# EAGLE schematic ControlBoard03_v03_short (EAGLE 7.7.0), part 1 of 2

## Sheet 1 of 10: RPi Zero 2 W
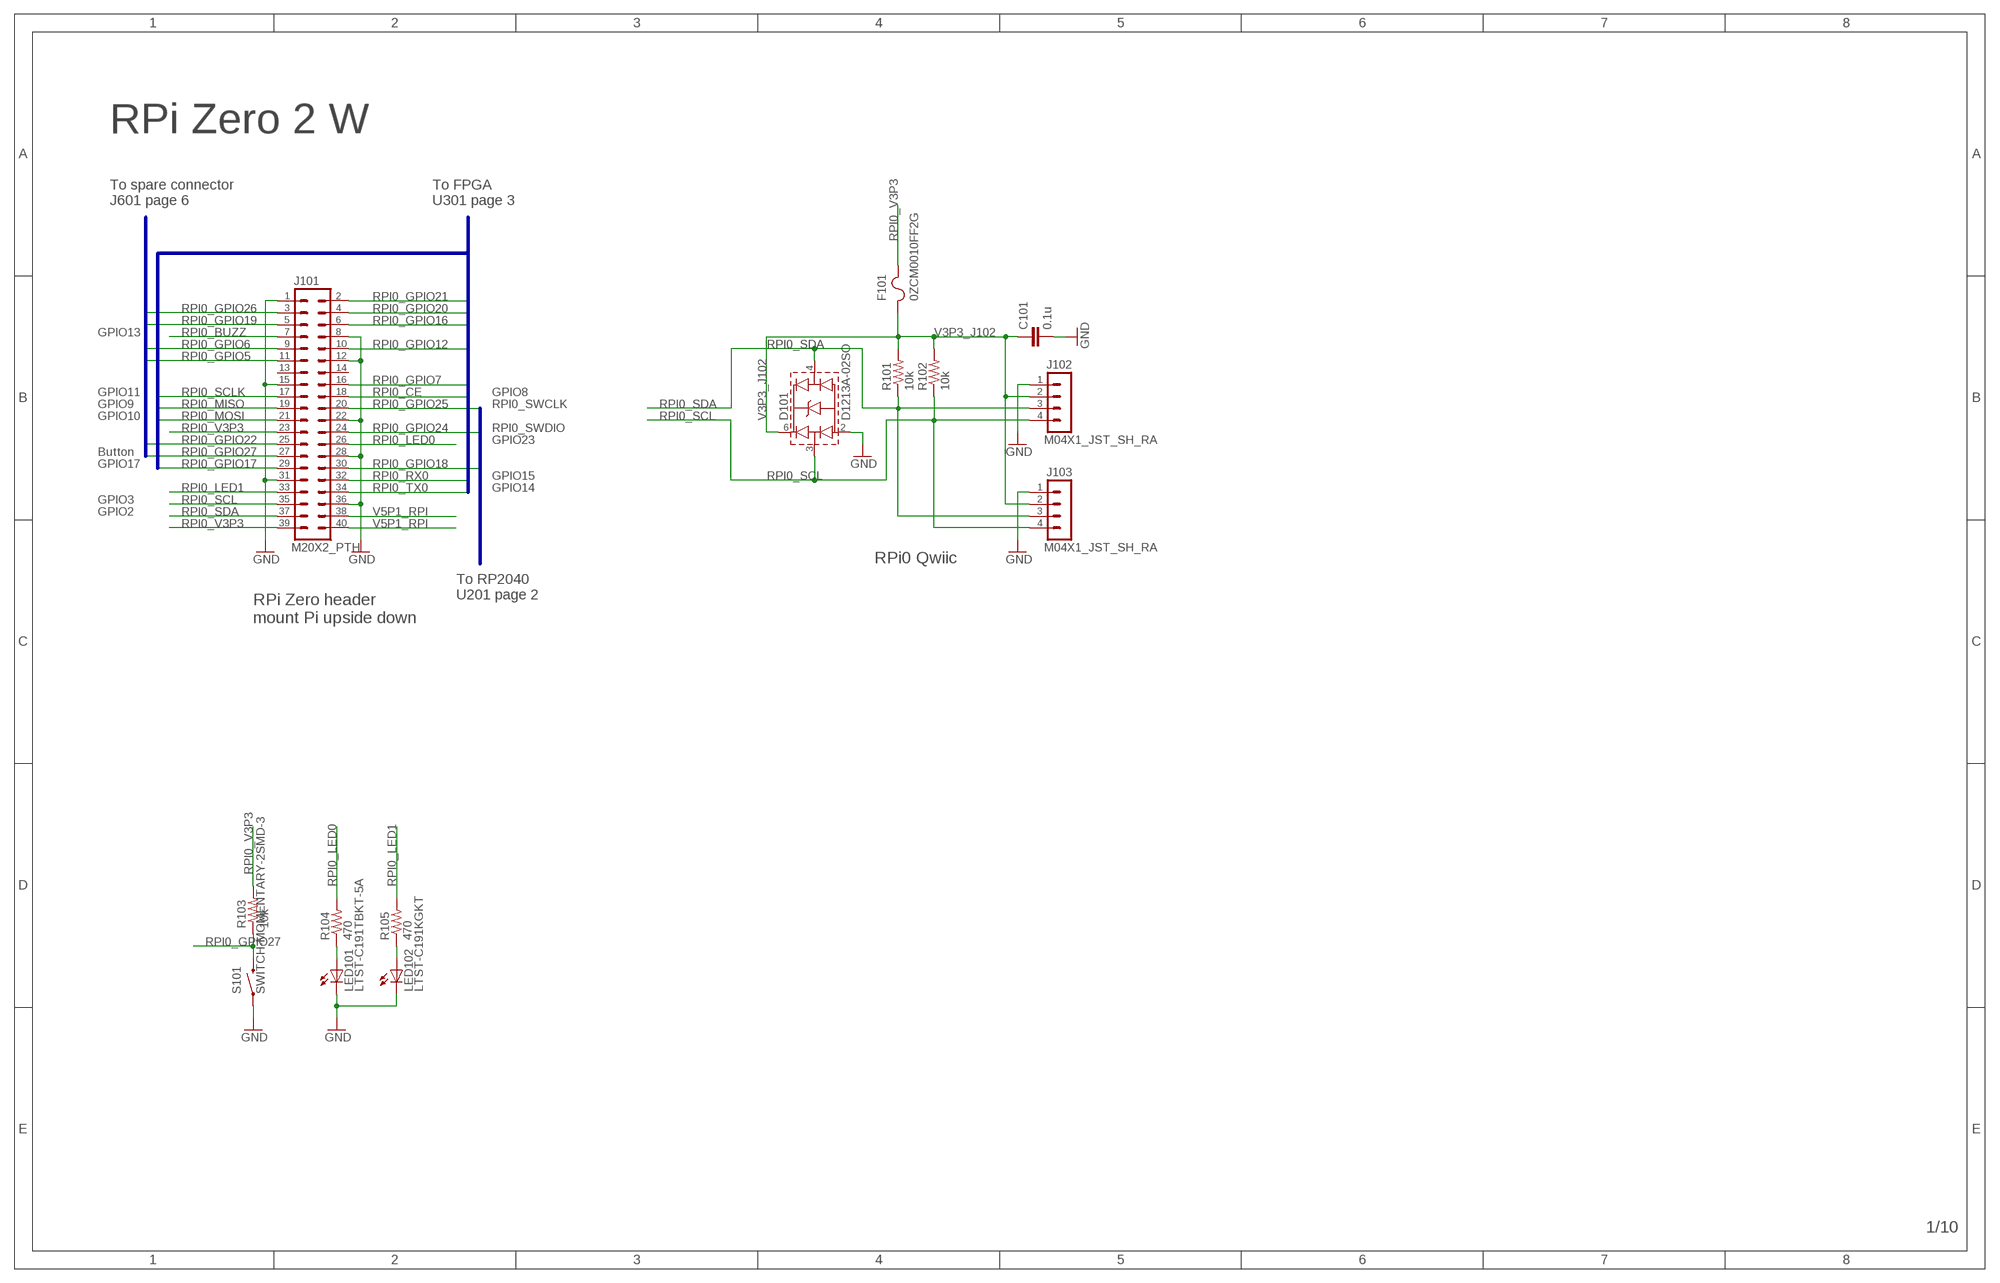
[diagram p0: schematic, sheet 1]

### Parts
C101  0.1u  CAP0402-CAP  [0402-CAP]
D101  D1213A-02SO  [SOT23-6]
F101  0ZCM0010FF2G  FUSE_0603  [0603-RES]
J101  M20X2_PTH  [M20X2_PTH]
J102  M04X1_JST_SH_RA  [M04X1_JST_SH_SM_RA]
J103  M04X1_JST_SH_RA  [M04X1_JST_SH_SM_RA]
LED101  LTST-C191TBKT-5A  LED0603  [LED-0603]
LED102  LTST-C191KGKT  LED0603  [LED-0603]
R101  10k  RESISTOR0402-RES  [0402-RES]
R102  10k  RESISTOR0402-RES  [0402-RES]
R103  10k  RESISTOR0402-RES  [0402-RES]
R104  470  RESISTOR0402-RES  [0402-RES]
R105  470  RESISTOR0402-RES  [0402-RES]
S101  SWITCH-MOMENTARY-2SMD-3  [TACTILE_SWITCH_SMD-3]

### Nets
GND: C101.2 D101.2(VN) J101.1 J101.8 J101.12 J101.15 J101.22 J101.28 J101.31 J101.36 J102.1 J103.1 LED101.C LED102.C S101.1 ; also sheet 2,3,4,5,6,7,8,9,10
N$86: LED101.A R104.1
N$88: LED102.A R105.1
RPI0_BUZZ: J101.7 ; also sheet 6
RPI0_CE: J101.18 ; also sheet 3
RPI0_GPIO5: J101.11
RPI0_GPIO6: J101.9
RPI0_GPIO7: J101.16 ; also sheet 3
RPI0_GPIO12: J101.10 ; also sheet 3
RPI0_GPIO16: J101.6 ; also sheet 3
RPI0_GPIO17: J101.29 ; also sheet 3
RPI0_GPIO18: J101.30 ; also sheet 2
RPI0_GPIO19: J101.5
RPI0_GPIO20: J101.4 ; also sheet 3
RPI0_GPIO21: J101.2 ; also sheet 3
RPI0_GPIO22: J101.25
RPI0_GPIO24: J101.24 ; also sheet 2
RPI0_GPIO25: J101.20 ; also sheet 2
RPI0_GPIO26: J101.3
RPI0_GPIO27: J101.27 R103.1 S101.4
RPI0_LED0: J101.26 R104.2
RPI0_LED1: J101.33 R105.2
RPI0_MISO: J101.19 ; also sheet 3
RPI0_MOSI: J101.21 ; also sheet 3
RPI0_RX0: J101.32 ; also sheet 3
RPI0_SCL: D101.3(CH1) J101.35 J102.4 J103.4 R102.1 ; also sheet 3
RPI0_SCLK: J101.17 ; also sheet 3
RPI0_SDA: D101.4(CH2) J101.37 J102.3 J103.3 R101.1 ; also sheet 3
RPI0_TX0: J101.34 ; also sheet 3
RPI0_V3P3: F101.2 J101.23 J101.39 R103.2
V3P3_J102: C101.1 D101.6(VP) F101.1 J102.2 J103.2 R101.2 R102.2
V5P1_RPI: J101.38 J101.40 ; also sheet 7
Unconnected: J101.13 J101.14

### Buses
RPI0_GPIO7,RPI0_GPIO12,RPI0_GPIO16,RPI0_GPIO20,RPI0_GPIO21,RPI0_SCLK,RPI0_MISO,RPI0_MOSI,RPI0_CE,RPI0_RX0,RPI0_TX0,RPI0_LED0
RPI0_GPIO18,RPI0_GPIO24,RPI0_GPIO25,RPI0_RX0,RPI0_TX0
RPI0_GPIO5,RPI0_GPIO6,RPI0_GPIO19,RPI0_GPIO22,RPI0_GPIO26,RPI0_GPIO27

### Notes on the sheet
- RPi Zero 2 W
- To spare connector
  J601 page 6
- To FPGA
  U301 page 3
- GPIO13
- GPIO11 | GPIO8
- GPIO9 | RPI0_SWCLK
- GPIO10
- RPI0_SWDIO
- GPIO23
- Button
- GPIO17
- GPIO15
- GPIO14
- GPIO3
- GPIO2
- RPi0 Qwiic
- To RP2040
  U201 page 2
- RPi Zero header
  mount Pi upside down

## Sheet 2 of 10: RP2040 MCU
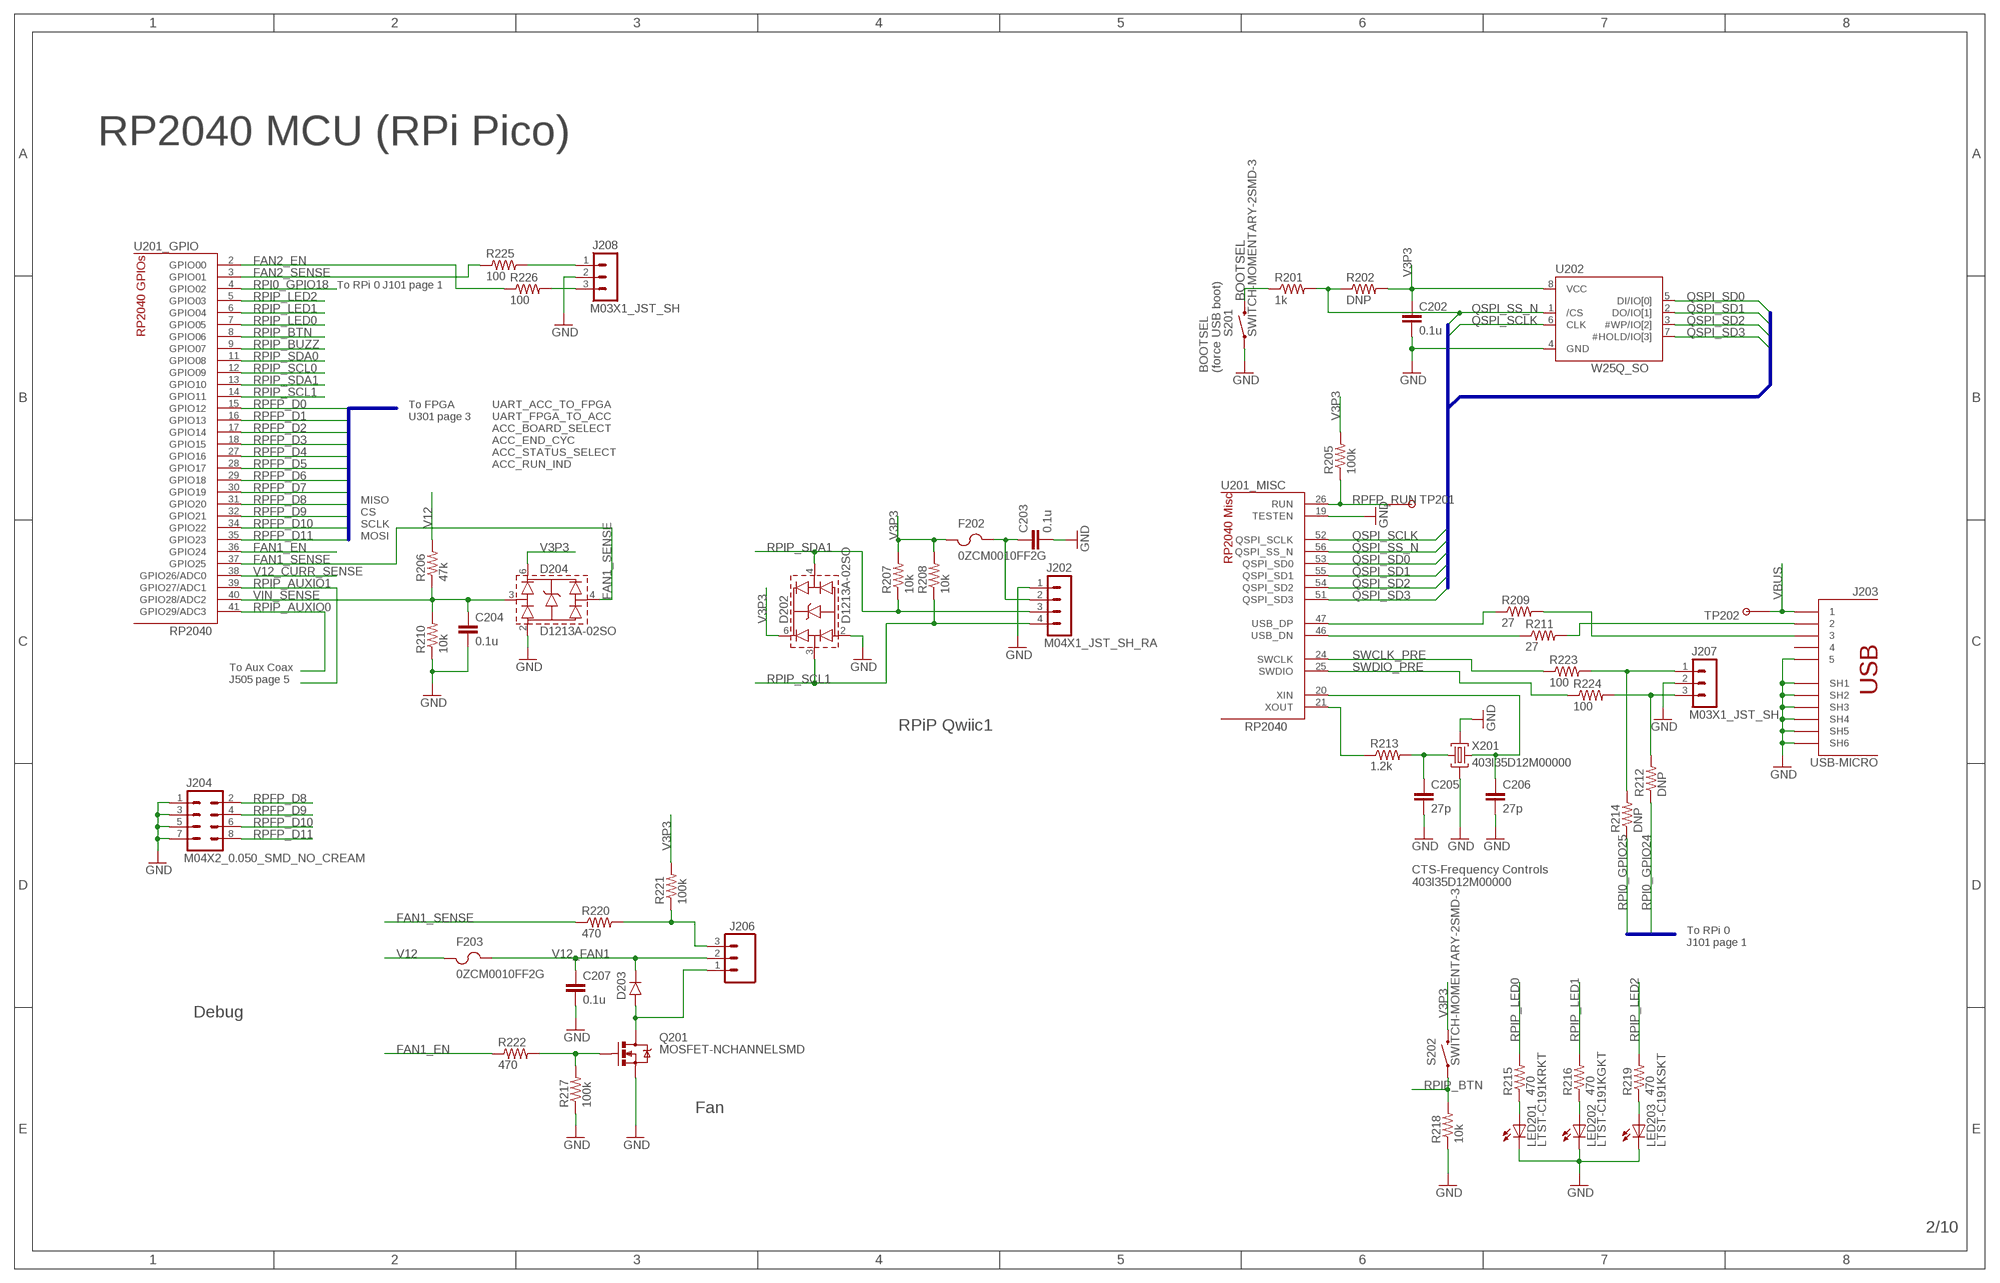
[diagram p1: schematic, sheet 2]

### Parts
C202  0.1u  CAP0402-CAP  [0402-CAP]
C203  0.1u  CAP0402-CAP  [0402-CAP]
C204  0.1u  CAP0402-CAP  [0402-CAP]
C205  27p  CAP0402-CAP  [0402-CAP]
C206  27p  CAP0402-CAP  [0402-CAP]
C207  0.1u  CAP0402-CAP  [0402-CAP]
D202  D1213A-02SO  [SOT23-6]
D203  DIODE_SOD523  [SOD523]
D204  D1213A-02SO  [SOT23-6]
F202  0ZCM0010FF2G  FUSE_0603  [0603-RES]
F203  0ZCM0010FF2G  FUSE_0603  [0603-RES]
J202  M04X1_JST_SH_RA  [M04X1_JST_SH_SM_RA]
J203  USB-MICRO  [USB-MICRO]
J204  M04X2_0.050_SMD_NO_CREAM  [M04X2_0.050_SMD_NO_CREAM]
J206  M03POLAR  [MOLEX-1X3]
J207  M03X1_JST_SH  [M03X1_JST_SH_SM]
J208  M03X1_JST_SH  [M03X1_JST_SH_SM]
LED201  LTST-C191KRKT  LED0603  [LED-0603]
LED202  LTST-C191KGKT  LED0603  [LED-0603]
LED203  LTST-C191KSKT  LED0603  [LED-0603]
Q201  MOSFET-NCHANNELSMD  [SOT23-3]
R201  1k  RESISTOR0402-RES  [0402-RES]
R202  DNP  RESISTOR0402-RES  [0402-RES]
R205  100k  RESISTOR0402-RES  [0402-RES]
R206  47k  RESISTOR0402-RES  [0402-RES]
R207  10k  RESISTOR0402-RES  [0402-RES]
R208  10k  RESISTOR0402-RES  [0402-RES]
R209  27  RESISTOR0402-RES  [0402-RES]
R210  10k  RESISTOR0402-RES  [0402-RES]
R211  27  RESISTOR0402-RES  [0402-RES]
R212  DNP  RESISTOR0402-RES  [0402-RES]
R213  1.2k  RESISTOR0402-RES  [0402-RES]
R214  DNP  RESISTOR0402-RES  [0402-RES]
R215  470  RESISTOR0402-RES  [0402-RES]
R216  470  RESISTOR0402-RES  [0402-RES]
R217  100k  RESISTOR0402-RES  [0402-RES]
R218  10k  RESISTOR0402-RES  [0402-RES]
R219  470  RESISTOR0402-RES  [0402-RES]
R220  470  RESISTOR0402-RES  [0402-RES]
R221  100k  RESISTOR0402-RES  [0402-RES]
R222  470  RESISTOR0402-RES  [0402-RES]
R223  100  RESISTOR0402-RES  [0402-RES]
R224  100  RESISTOR0402-RES  [0402-RES]
R225  100  RESISTOR0402-RES  [0402-RES]
R226  100  RESISTOR0402-RES  [0402-RES]
S201  SWITCH-MOMENTARY-2SMD-3  [TACTILE_SWITCH_SMD-3]
S202  SWITCH-MOMENTARY-2SMD-3  [TACTILE_SWITCH_SMD-3]
TP201  TESTPOINT_ROUND  [TESTPAD_ROUND]
TP202  TESTPOINT_ROUND  [TESTPAD_ROUND]
U201  RP2040  [QFN-56_EP]
U202  W25Q_SO  [SO08-208MIL]
X201  403I35D12M00000  CRYSTAL-3.2-2.5  [CRYSTAL-3.2-2.5]

### Nets
BOOTSEL: R201.1 S201.4
FAN1_EN: R222.1 U201.36(_GPIO:GPIO24)
FAN1_SENSE: D204.4(CH2) R220.1 U201.37(_GPIO:GPIO25)
FAN2_EN: R226.1 U201.2(_GPIO:GPIO00)
FAN2_SENSE: R225.1 U201.3(_GPIO:GPIO01)
GND: C202.2 C203.2 C204.2 C205.2 C206.2 C207.2 D202.2(VN) D204.2(VN) J202.1 J203.5 J203.SH1 J203.SH2 J203.SH3 J203.SH4 J203.SH5 J203.SH6 J204.1 J204.3 J204.5 J204.7 J207.2 J208.2 LED201.C LED202.C LED203.C Q201.2(S) R210.1 R217.1 R218.1 S201.1 U201.19(_MISC:TESTEN) U202.4(GND) X201.2(GND) X201.4(GND) ; also sheet 1,3,4,5,6,7,8,9,10
N$16: C206.1 U201.20(_MISC:XIN) X201.3(C2)
N$17: C205.1 R213.2 X201.1(C1)
N$18: R213.1 U201.21(_MISC:XOUT)
N$29: R209.1 U201.47(_MISC:USB_DP)
N$30: R211.1 U201.46(_MISC:USB_DN)
N$35: J203.2 R211.2
N$37: J203.3 R209.2
N$46: J208.3 R226.2
N$47: J208.1 R225.2
N$63: LED203.A R219.1
N$83: J206.3 R220.2 R221.1
N$85: LED202.A R216.1
N$91: LED201.A R215.1
N$92: D203.A J206.1 Q201.3(D)
N$98: Q201.1(G) R217.2 R222.2
QSPI_SCLK: U201.52(_MISC:QSPI_SCLK) U202.6(CLK)
QSPI_SD0: U201.53(_MISC:QSPI_SD0) U202.5(DI/IO[0])
QSPI_SD1: U201.55(_MISC:QSPI_SD1) U202.2(DO/IO[1])
QSPI_SD2: U201.54(_MISC:QSPI_SD2) U202.3(#WP/IO[2])
QSPI_SD3: U201.51(_MISC:QSPI_SD3) U202.7(#HOLD/IO[3])
QSPI_SS_N: R201.2 R202.1 U201.56(_MISC:QSPI_SS_N) U202.1(/CS)
RPFP_D0: U201.15(_GPIO:GPIO12) ; also sheet 3
RPFP_D1: U201.16(_GPIO:GPIO13) ; also sheet 3
RPFP_D2: U201.17(_GPIO:GPIO14) ; also sheet 3
RPFP_D3: U201.18(_GPIO:GPIO15) ; also sheet 3
RPFP_D4: U201.27(_GPIO:GPIO16) ; also sheet 3
RPFP_D5: U201.28(_GPIO:GPIO17) ; also sheet 3
RPFP_D6: U201.29(_GPIO:GPIO18) ; also sheet 3
RPFP_D7: U201.30(_GPIO:GPIO19) ; also sheet 3
RPFP_D8: J204.2 U201.31(_GPIO:GPIO20) ; also sheet 3
RPFP_D9: J204.4 U201.32(_GPIO:GPIO21) ; also sheet 3
RPFP_D10: J204.6 U201.34(_GPIO:GPIO22) ; also sheet 3
RPFP_D11: J204.8 U201.35(_GPIO:GPIO23) ; also sheet 3
RPFP_RUN: R205.1 TP201.P$1 U201.26(_MISC:RUN) ; also sheet 3
RPI0_GPIO18: U201.4(_GPIO:GPIO02) ; also sheet 1
RPI0_GPIO24: R212.1 ; also sheet 1
RPI0_GPIO25: R214.1 ; also sheet 1
RPIP_AUXIO0: U201.41(_GPIO:GPIO29/ADC3) ; also sheet 5
RPIP_AUXIO1: U201.39(_GPIO:GPIO27/ADC1) ; also sheet 5
RPIP_BTN: R218.2 S202.1 U201.8(_GPIO:GPIO06)
RPIP_BUZZ: U201.9(_GPIO:GPIO07) ; also sheet 6
RPIP_LED0: R215.2 U201.7(_GPIO:GPIO05)
RPIP_LED1: R216.2 U201.6(_GPIO:GPIO04)
RPIP_LED2: R219.2 U201.5(_GPIO:GPIO03)
RPIP_SCL0: U201.12(_GPIO:GPIO09)
RPIP_SCL1: D202.3(CH1) J202.4 R208.1 U201.14(_GPIO:GPIO11)
RPIP_SDA0: U201.11(_GPIO:GPIO08)
RPIP_SDA1: D202.4(CH2) J202.3 R207.1 U201.13(_GPIO:GPIO10)
SWCLK: J207.1 R214.2 R223.2
SWCLK_PRE: R223.1 U201.24(_MISC:SWCLK)
SWDIO: J207.3 R212.2 R224.2
SWDIO_PRE: R224.1 U201.25(_MISC:SWDIO)
V3P3: C202.1 D202.6(VP) D204.6(VP) F202.1 R202.2 R205.2 R207.2 R208.2 R221.2 S202.4 U202.8(VCC) ; also sheet 3,5,6,7,9,10
V3P3_J202: C203.1 F202.2 J202.2
V12: F203.1 R206.2 ; also sheet 7,8,9,10
V12_CURR_SENSE: U201.38(_GPIO:GPIO26/ADC0) ; also sheet 10
V12_FAN1: C207.1 D203.C F203.2 J206.2
VBUS: J203.1 TP202.P$1
VIN_SENSE: C204.1 D204.3(CH1) R206.1 R210.2 U201.40(_GPIO:GPIO28/ADC2)
Unconnected: J203.4

### Buses
QSPI_SCLK,QSPI_SS_N,QSPI_SD[0..3]
RPI0_GPIO18,RPI0_GPIO24,RPI0_GPIO25,RPI0_RX0,RPI0_TX0
RPIP_GPIO[12..19],RPIP_MISO0,RPIP_MOSI0,RPIP_SCLK0,RPIP_CS0

### Notes on the sheet
- RP2040 MCU (RPi Pico)
- To RPi 0 J101 page 1
- BOOTSEL
  (force USB boot)
- UART_ACC_TO_FPGA
- To FPGA
  U301 page 3
- UART_FPGA_TO_ACC
- ACC_BOARD_SELECT
- ACC_END_CYC
- ACC_STATUS_SELECT
- ACC_RUN_IND
- MISO
- CS
- SCLK
- MOSI
- To Aux Coax
  J505 page 5
- RPiP Qwiic1
- CTS-Frequency Controls
  403I35D12M00000
- To RPi 0
  J101 page 1
- Debug
- Fan

## Sheet 3 of 10: FPGA
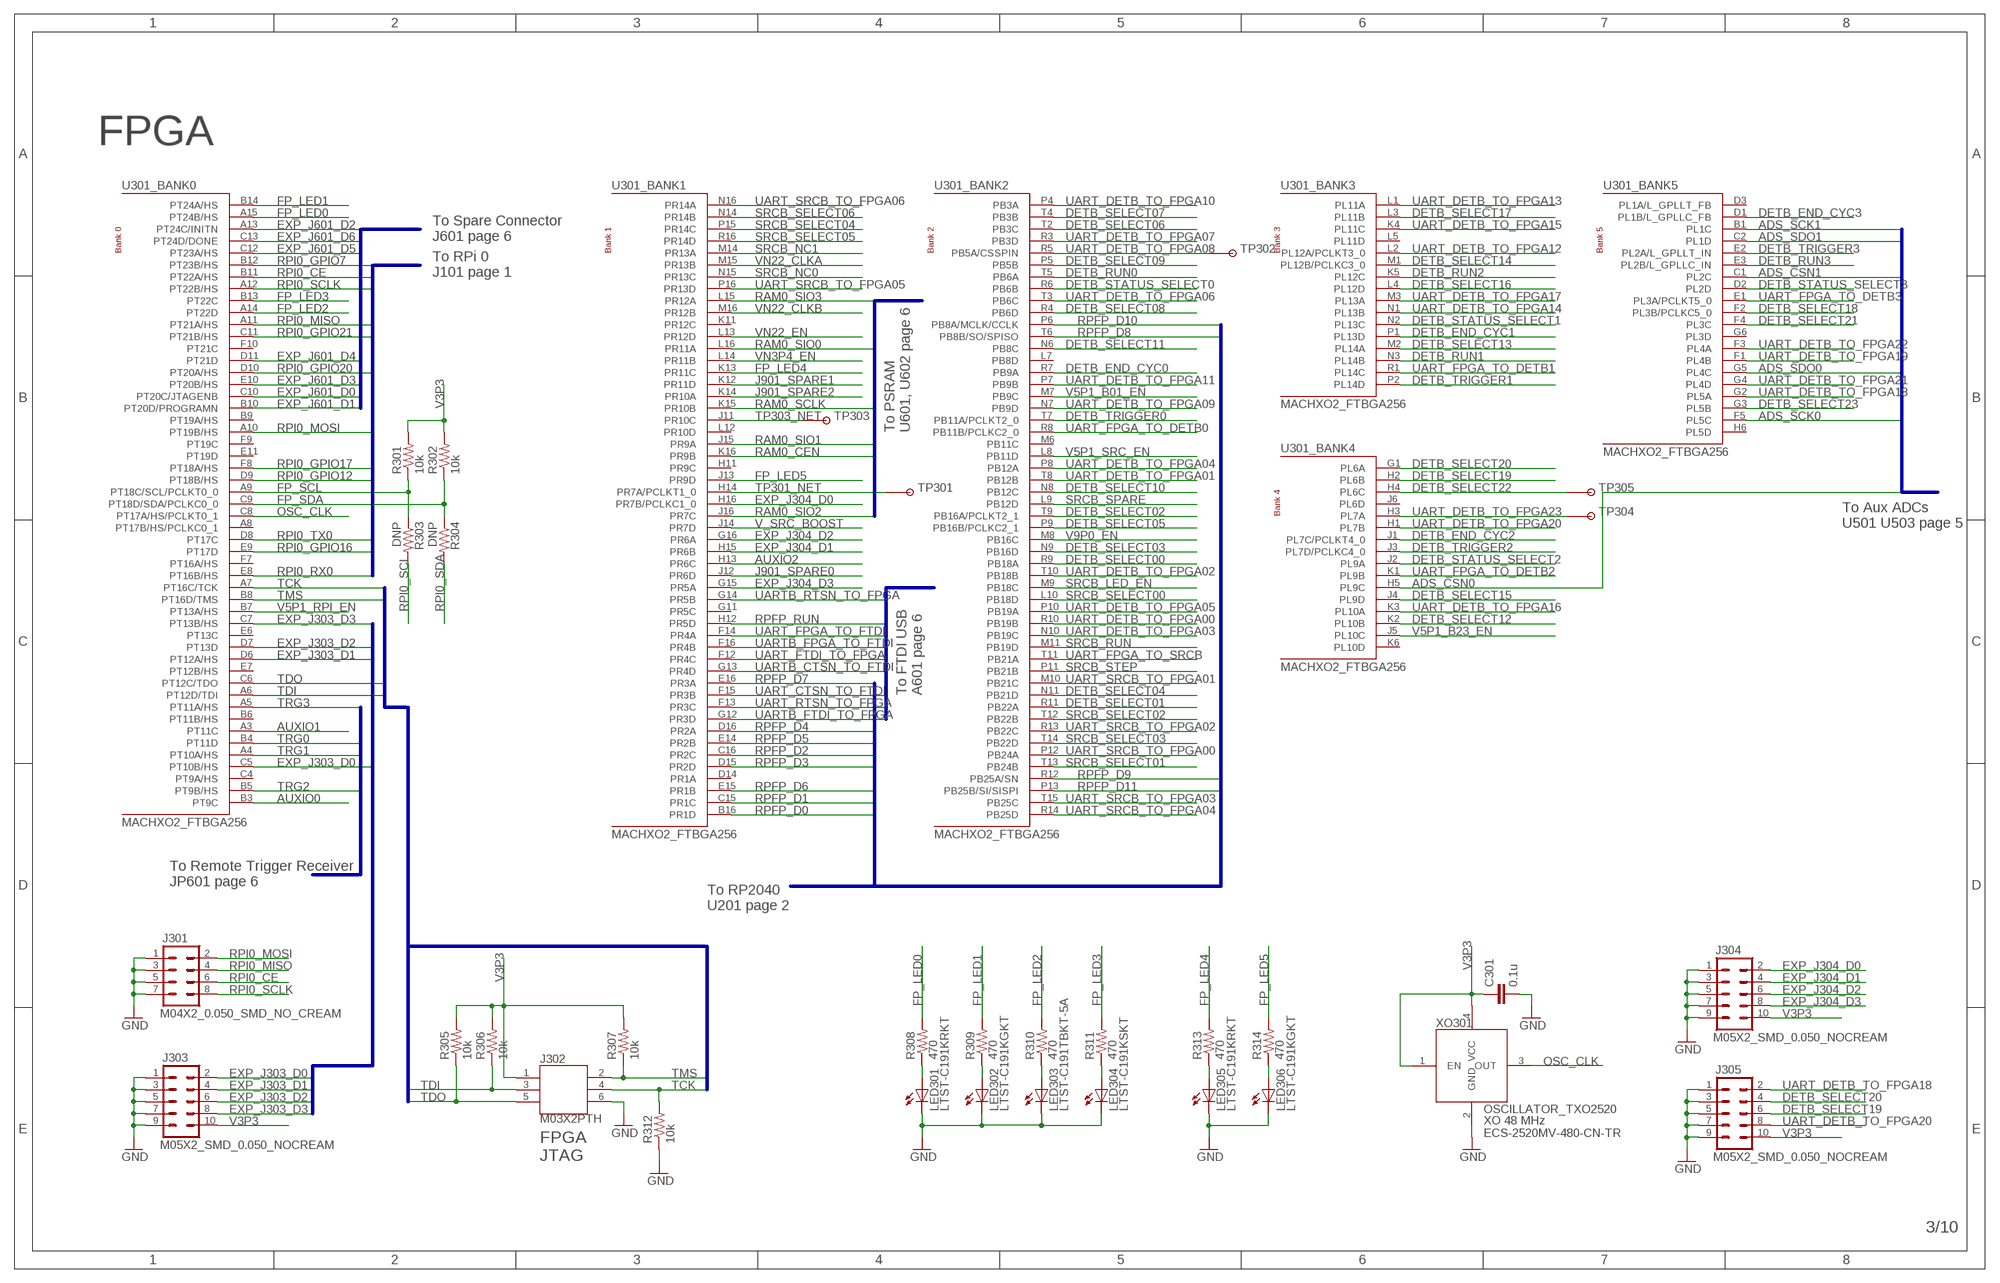
[diagram p2: schematic, sheet 3]

### Parts
C301  0.1u  CAP0402-CAP  [0402-CAP]
J301  M04X2_0.050_SMD_NO_CREAM  [M04X2_0.050_SMD_NO_CREAM]
J302  M03X2PTH  [2X3-NS]
J303  M05X2_SMD_0.050_NOCREAM  [M05X2_0.050_SMD_NO_CREAM]
J304  M05X2_SMD_0.050_NOCREAM  [M05X2_0.050_SMD_NO_CREAM]
J305  M05X2_SMD_0.050_NOCREAM  [M05X2_0.050_SMD_NO_CREAM]
LED301  LTST-C191KRKT  LED0603  [LED-0603]
LED302  LTST-C191KGKT  LED0603  [LED-0603]
LED303  LTST-C191TBKT-5A  LED0603  [LED-0603]
LED304  LTST-C191KSKT  LED0603  [LED-0603]
LED305  LTST-C191KRKT  LED0603  [LED-0603]
LED306  LTST-C191KGKT  LED0603  [LED-0603]
R301  10k  RESISTOR0402-RES  [0402-RES]
R302  10k  RESISTOR0402-RES  [0402-RES]
R303  DNP  RESISTOR0402-RES  [0402-RES]
R304  DNP  RESISTOR0402-RES  [0402-RES]
R305  10k  RESISTOR0402-RES  [0402-RES]
R306  10k  RESISTOR0402-RES  [0402-RES]
R307  10k  RESISTOR0402-RES  [0402-RES]
R308  470  RESISTOR0402-RES  [0402-RES]
R309  470  RESISTOR0402-RES  [0402-RES]
R310  470  RESISTOR0402-RES  [0402-RES]
R311  470  RESISTOR0402-RES  [0402-RES]
R312  10k  RESISTOR0402-RES  [0402-RES]
R313  470  RESISTOR0402-RES  [0402-RES]
R314  470  RESISTOR0402-RES  [0402-RES]
TP301  TESTPOINT_ROUND  [TESTPAD_ROUND]
TP302  TESTPOINTPADSMALL  [TESTPAD_SMALL]
TP303  TESTPOINT_ROUND  [TESTPAD_ROUND]
TP304  TESTPOINT_ROUND  [TESTPAD_ROUND]
TP305  TESTPOINT_ROUND  [TESTPAD_ROUND]
U301  MACHXO2_FTBGA256  [LBGA-256]
XO301  OSCILLATOR_TXO2520  [TXO2520]

### Nets
ADS_CSN0: U301.H5(_BANK4:PL9C)
ADS_CSN1: U301.C1(_BANK5:PL2C)
ADS_SCK0: U301.F5(_BANK5:PL5C)
ADS_SCK1: U301.B1(_BANK5:PL1C)
ADS_SDO0: U301.G5(_BANK5:PL4C)
ADS_SDO1: U301.C2(_BANK5:PL1D)
AUXIO0: U301.B3(_BANK0:PT9C) ; also sheet 5
AUXIO1: U301.A3(_BANK0:PT11C) ; also sheet 5
AUXIO2: U301.H13(_BANK1:PR6C) ; also sheet 5
DETB_END_CYC0: U301.R7(_BANK2:PB9A) ; also sheet 4
DETB_END_CYC1: U301.P1(_BANK3:PL13D) ; also sheet 4
DETB_END_CYC2: U301.J1(_BANK4:PL7C/PCLKT4_0) ; also sheet 4
DETB_END_CYC3: U301.D1(_BANK5:PL1B/L_GPLLC_FB)
DETB_RUN0: U301.T5(_BANK2:PB6A) ; also sheet 4
DETB_RUN1: U301.N3(_BANK3:PL14B) ; also sheet 4
DETB_RUN2: U301.K5(_BANK3:PL12C) ; also sheet 4
DETB_RUN3: U301.E3(_BANK5:PL2B/L_GPLLC_IN)
DETB_SELECT00: U301.R9(_BANK2:PB18A) ; also sheet 4
DETB_SELECT01: U301.R11(_BANK2:PB22A) ; also sheet 4
DETB_SELECT02: U301.T9(_BANK2:PB16A/PCLKT2_1) ; also sheet 4
DETB_SELECT03: U301.N9(_BANK2:PB16D) ; also sheet 4
DETB_SELECT04: U301.N11(_BANK2:PB21D) ; also sheet 4
DETB_SELECT05: U301.P9(_BANK2:PB16B/PCLKC2_1) ; also sheet 4
DETB_SELECT06: U301.T2(_BANK2:PB3C) ; also sheet 4
DETB_SELECT07: U301.T4(_BANK2:PB3B) ; also sheet 4
DETB_SELECT08: U301.R4(_BANK2:PB6D) ; also sheet 4
DETB_SELECT09: U301.P5(_BANK2:PB5B) ; also sheet 4
DETB_SELECT10: U301.N8(_BANK2:PB12C) ; also sheet 4
DETB_SELECT11: U301.N6(_BANK2:PB8C) ; also sheet 4
DETB_SELECT12: U301.K2(_BANK4:PL10B) ; also sheet 4
DETB_SELECT13: U301.M2(_BANK3:PL14A) ; also sheet 4
DETB_SELECT14: U301.M1(_BANK3:PL12B/PCLKC3_0) ; also sheet 4
DETB_SELECT15: U301.J4(_BANK4:PL9D) ; also sheet 4
DETB_SELECT16: U301.L4(_BANK3:PL12D) ; also sheet 4
DETB_SELECT17: U301.L3(_BANK3:PL11B) ; also sheet 4
DETB_SELECT18: U301.F2(_BANK5:PL3B/PCLKC5_0)
DETB_SELECT19: J305.6 U301.H2(_BANK4:PL6B)
DETB_SELECT20: J305.4 U301.G1(_BANK4:PL6A)
DETB_SELECT21: U301.F4(_BANK5:PL3C)
DETB_SELECT22: TP305.P$1 U301.H4(_BANK4:PL6C)
DETB_SELECT23: U301.G3(_BANK5:PL5B)
DETB_STATUS_SELECT0: U301.R6(_BANK2:PB6B) ; also sheet 4
DETB_STATUS_SELECT1: U301.N2(_BANK3:PL13C) ; also sheet 4
DETB_STATUS_SELECT2: U301.J2(_BANK4:PL9A) ; also sheet 4
DETB_STATUS_SELECT3: U301.D2(_BANK5:PL2D)
DETB_TRIGGER0: U301.T7(_BANK2:PB11A/PCLKT2_0) ; also sheet 4
DETB_TRIGGER1: U301.P2(_BANK3:PL14D) ; also sheet 4
DETB_TRIGGER2: U301.J3(_BANK4:PL7D/PCLKC4_0) ; also sheet 4
DETB_TRIGGER3: U301.E2(_BANK5:PL2A/L_GPLLT_IN)
EXP_J303_D0: J303.2 U301.C5(_BANK0:PT10B/HS)
EXP_J303_D1: J303.4 U301.D6(_BANK0:PT12A/HS)
EXP_J303_D2: J303.6 U301.D7(_BANK0:PT13D)
EXP_J303_D3: J303.8 U301.C7(_BANK0:PT13B/HS)
EXP_J304_D0: J304.2 U301.H16(_BANK1:PR7B/PCLKC1_0)
EXP_J304_D1: J304.4 U301.H15(_BANK1:PR6B)
EXP_J304_D2: J304.6 U301.G16(_BANK1:PR6A)
EXP_J304_D3: J304.8 U301.G15(_BANK1:PR5A)
EXP_J601_D0: U301.C10(_BANK0:PT20C/JTAGENB)
EXP_J601_D1: U301.B10(_BANK0:PT20D/PROGRAMN)
EXP_J601_D2: U301.A13(_BANK0:PT24C/INITN)
EXP_J601_D3: U301.E10(_BANK0:PT20B/HS)
EXP_J601_D4: U301.D11(_BANK0:PT21D)
EXP_J601_D5: U301.C12(_BANK0:PT23A/HS)
EXP_J601_D6: U301.C13(_BANK0:PT24D/DONE)
FP_LED0: R308.2 U301.A15(_BANK0:PT24B/HS)
FP_LED1: R309.2 U301.B14(_BANK0:PT24A/HS)
FP_LED2: R310.2 U301.A14(_BANK0:PT22D)
FP_LED3: R311.2 U301.B13(_BANK0:PT22C)
FP_LED4: R313.2 U301.K13(_BANK1:PR11C)
FP_LED5: R314.2 U301.J13(_BANK1:PR9D)
FP_SCL: R301.1 R303.1 U301.A9(_BANK0:PT18C/SCL/PCLKT0_0)
FP_SDA: R302.1 R304.1 U301.C9(_BANK0:PT18D/SDA/PCLKC0_0)
GND: C301.2 J301.1 J301.3 J301.5 J301.7 J302.6 J303.1 J303.3 J303.5 J303.7 J303.9 J304.1 J304.3 J304.5 J304.7 J304.9 J305.1 J305.3 J305.5 J305.7 J305.9 LED301.C LED302.C LED303.C LED304.C LED305.C LED306.C R312.1 XO301.2(GND) ; also sheet 1,2,4,5,6,7,8,9,10
J901_SPARE0: U301.J12(_BANK1:PR6D) ; also sheet 9
J901_SPARE1: U301.K12(_BANK1:PR11D) ; also sheet 9
J901_SPARE2: U301.K14(_BANK1:PR10A) ; also sheet 9
N$55: LED301.A R308.1
N$56: LED302.A R309.1
N$57: LED303.A R310.1
N$58: LED304.A R311.1
N$84: LED305.A R313.1
N$90: LED306.A R314.1
OSC_CLK: U301.C8(_BANK0:PT17A/HS/PCLKT0_1) XO301.3(OUT)
RAM0_CEN: U301.K16(_BANK1:PR9B) ; also sheet 6
RAM0_SCLK: U301.K15(_BANK1:PR10B) ; also sheet 6
RAM0_SIO0: U301.L16(_BANK1:PR11A) ; also sheet 6
RAM0_SIO1: U301.J15(_BANK1:PR9A) ; also sheet 6
RAM0_SIO2: U301.J16(_BANK1:PR7C) ; also sheet 6
RAM0_SIO3: U301.L15(_BANK1:PR12A) ; also sheet 6
RPFP_D0: U301.B16(_BANK1:PR1D) ; also sheet 2
RPFP_D1: U301.C15(_BANK1:PR1C) ; also sheet 2
RPFP_D2: U301.C16(_BANK1:PR2C) ; also sheet 2
RPFP_D3: U301.D15(_BANK1:PR2D) ; also sheet 2
RPFP_D4: U301.D16(_BANK1:PR2A) ; also sheet 2
RPFP_D5: U301.E14(_BANK1:PR2B) ; also sheet 2
RPFP_D6: U301.E15(_BANK1:PR1B) ; also sheet 2
RPFP_D7: U301.E16(_BANK1:PR3A) ; also sheet 2
RPFP_D8: U301.T6(_BANK2:PB8B/SO/SPISO) ; also sheet 2
RPFP_D9: U301.R12(_BANK2:PB25A/SN) ; also sheet 2
RPFP_D10: U301.P6(_BANK2:PB8A/MCLK/CCLK) ; also sheet 2
RPFP_D11: U301.P13(_BANK2:PB25B/SI/SISPI) ; also sheet 2
RPFP_RUN: U301.H12(_BANK1:PR5D) ; also sheet 2
RPI0_CE: J301.6 U301.B11(_BANK0:PT22A/HS) ; also sheet 1
RPI0_GPIO7: U301.B12(_BANK0:PT23B/HS) ; also sheet 1
RPI0_GPIO12: U301.D9(_BANK0:PT18B/HS) ; also sheet 1
RPI0_GPIO16: U301.E9(_BANK0:PT17D) ; also sheet 1
RPI0_GPIO17: U301.F8(_BANK0:PT18A/HS) ; also sheet 1
RPI0_GPIO20: U301.D10(_BANK0:PT20A/HS) ; also sheet 1
RPI0_GPIO21: U301.C11(_BANK0:PT21B/HS) ; also sheet 1
RPI0_MISO: J301.4 U301.A11(_BANK0:PT21A/HS) ; also sheet 1
RPI0_MOSI: J301.2 U301.A10(_BANK0:PT19B/HS) ; also sheet 1
RPI0_RX0: U301.E8(_BANK0:PT16B/HS) ; also sheet 1
RPI0_SCL: R303.2 ; also sheet 1
RPI0_SCLK: J301.8 U301.A12(_BANK0:PT22B/HS) ; also sheet 1
RPI0_SDA: R304.2 ; also sheet 1
RPI0_TX0: U301.D8(_BANK0:PT17C) ; also sheet 1
SRCB_LED_EN: U301.M9(_BANK2:PB18C) ; also sheet 4
SRCB_NC0: U301.N15(_BANK1:PR13C) ; also sheet 4
SRCB_NC1: U301.M14(_BANK1:PR13A) ; also sheet 4
SRCB_RUN: U301.M11(_BANK2:PB19D) ; also sheet 4
SRCB_SELECT00: U301.L10(_BANK2:PB18D) ; also sheet 4
SRCB_SELECT01: U301.T13(_BANK2:PB24B) ; also sheet 4
SRCB_SELECT02: U301.T12(_BANK2:PB22B) ; also sheet 4
SRCB_SELECT03: U301.T14(_BANK2:PB22D) ; also sheet 4
SRCB_SELECT04: U301.P15(_BANK1:PR14C) ; also sheet 4
SRCB_SELECT05: U301.R16(_BANK1:PR14D) ; also sheet 4
SRCB_SELECT06: U301.N14(_BANK1:PR14B) ; also sheet 4
SRCB_SPARE: U301.L9(_BANK2:PB12D) ; also sheet 4
SRCB_STEP: U301.P11(_BANK2:PB21B) ; also sheet 4
TCK: J302.4 R312.2 U301.A7(_BANK0:PT16C/TCK)
TDI: J302.3 R306.1 U301.A6(_BANK0:PT12D/TDI)
TDO: J302.5 R305.1 U301.C6(_BANK0:PT12C/TDO)
TMS: J302.2 R307.1 U301.B8(_BANK0:PT16D/TMS)
TP301_NET: TP301.P$1 U301.H14(_BANK1:PR7A/PCLKT1_0)
TP303_NET: TP303.P$1 U301.J11(_BANK1:PR10C)
TRG0: U301.B4(_BANK0:PT11D) ; also sheet 6
TRG1: U301.A4(_BANK0:PT10A/HS) ; also sheet 6
TRG2: U301.B5(_BANK0:PT9B/HS) ; also sheet 6
TRG3: U301.A5(_BANK0:PT11A/HS) ; also sheet 6
UART_CTSN_TO_FTDI: U301.F15(_BANK1:PR3B) ; also sheet 6
UART_DETB_TO_FPGA00: U301.R10(_BANK2:PB19B) ; also sheet 4
UART_DETB_TO_FPGA01: U301.T8(_BANK2:PB12B) ; also sheet 4
UART_DETB_TO_FPGA02: U301.T10(_BANK2:PB18B) ; also sheet 4
UART_DETB_TO_FPGA03: U301.N10(_BANK2:PB19C) ; also sheet 4
UART_DETB_TO_FPGA04: U301.P8(_BANK2:PB12A) ; also sheet 4
UART_DETB_TO_FPGA05: U301.P10(_BANK2:PB19A) ; also sheet 4
UART_DETB_TO_FPGA06: U301.T3(_BANK2:PB6C) ; also sheet 4
UART_DETB_TO_FPGA07: U301.R3(_BANK2:PB3D) ; also sheet 4
UART_DETB_TO_FPGA08: TP302.P$1 U301.R5(_BANK2:PB5A/CSSPIN) ; also sheet 4
UART_DETB_TO_FPGA09: U301.N7(_BANK2:PB9D) ; also sheet 4
UART_DETB_TO_FPGA10: U301.P4(_BANK2:PB3A) ; also sheet 4
UART_DETB_TO_FPGA11: U301.P7(_BANK2:PB9B) ; also sheet 4
UART_DETB_TO_FPGA12: U301.L2(_BANK3:PL12A/PCLKT3_0) ; also sheet 4
UART_DETB_TO_FPGA13: U301.L1(_BANK3:PL11A) ; also sheet 4
UART_DETB_TO_FPGA14: U301.N1(_BANK3:PL13B) ; also sheet 4
UART_DETB_TO_FPGA15: U301.K4(_BANK3:PL11C) ; also sheet 4
UART_DETB_TO_FPGA16: U301.K3(_BANK4:PL10A) ; also sheet 4
UART_DETB_TO_FPGA17: U301.M3(_BANK3:PL13A) ; also sheet 4
UART_DETB_TO_FPGA18: J305.2 U301.G2(_BANK5:PL5A)
UART_DETB_TO_FPGA19: U301.F1(_BANK5:PL4B)
UART_DETB_TO_FPGA20: J305.8 U301.H1(_BANK4:PL7B)
UART_DETB_TO_FPGA21: U301.G4(_BANK5:PL4D)
UART_DETB_TO_FPGA22: U301.F3(_BANK5:PL4A)
UART_DETB_TO_FPGA23: TP304.P$1 U301.H3(_BANK4:PL7A)
UART_FPGA_TO_DETB0: U301.R8(_BANK2:PB11B/PCLKC2_0) ; also sheet 4
UART_FPGA_TO_DETB1: U301.R1(_BANK3:PL14C) ; also sheet 4
UART_FPGA_TO_DETB2: U301.K1(_BANK4:PL9B) ; also sheet 4
UART_FPGA_TO_DETB3: U301.E1(_BANK5:PL3A/PCLKT5_0)
UART_FPGA_TO_FTDI: U301.F14(_BANK1:PR4A) ; also sheet 6
UART_FPGA_TO_SRCB: U301.T11(_BANK2:PB21A) ; also sheet 4
UART_FTDI_TO_FPGA: U301.F12(_BANK1:PR4C) ; also sheet 6
UART_RTSN_TO_FPGA: U301.F13(_BANK1:PR3C) ; also sheet 6
UART_SRCB_TO_FPGA00: U301.P12(_BANK2:PB24A) ; also sheet 4
UART_SRCB_TO_FPGA01: U301.M10(_BANK2:PB21C) ; also sheet 4
UART_SRCB_TO_FPGA02: U301.R13(_BANK2:PB22C) ; also sheet 4
UART_SRCB_TO_FPGA03: U301.T15(_BANK2:PB25C) ; also sheet 4
UART_SRCB_TO_FPGA04: U301.R14(_BANK2:PB25D) ; also sheet 4
UART_SRCB_TO_FPGA05: U301.P16(_BANK1:PR13D) ; also sheet 4
UART_SRCB_TO_FPGA06: U301.N16(_BANK1:PR14A) ; also sheet 4
UARTB_CTSN_TO_FTDI: U301.G13(_BANK1:PR4D) ; also sheet 6
UARTB_FPGA_TO_FTDI: U301.F16(_BANK1:PR4B) ; also sheet 6
UARTB_FTDI_TO_FPGA: U301.G12(_BANK1:PR3D) ; also sheet 6
UARTB_RTSN_TO_FPGA: U301.G14(_BANK1:PR5B) ; also sheet 6
V3P3: C301.1 J302.1 J303.10 J304.10 J305.10 R301.2 R302.2 R305.2 R306.2 R307.2 XO301.1(EN) XO301.4(VCC) ; also sheet 2,5,6,7,9,10
V5P1_B01_EN: U301.M7(_BANK2:PB9C) ; also sheet 7
V5P1_B23_EN: U301.J5(_BANK4:PL10C)
V5P1_RPI_EN: U301.B7(_BANK0:PT13A/HS) ; also sheet 7
V5P1_SRC_EN: U301.L8(_BANK2:PB11D) ; also sheet 7
V9P0_EN: U301.M8(_BANK2:PB16C) ; also sheet 9
V_SRC_BOOST: U301.J14(_BANK1:PR7D) ; also sheet 7
VN3P4_EN: U301.L14(_BANK1:PR11B) ; also sheet 8
VN22_CLKA: U301.M15(_BANK1:PR13B) ; also sheet 8
VN22_CLKB: U301.M16(_BANK1:PR12B) ; also sheet 8
VN22_EN: U301.L13(_BANK1:PR12D) ; also sheet 8
Unconnected: U301.A8(_BANK0:PT17B/HS/PCLKC0_1) U301.B6(_BANK0:PT11B/HS) U301.B9(_BANK0:PT19A/HS) U301.C4(_BANK0:PT9A/HS) U301.D3(_BANK5:PL1A/L_GPLLT_FB) U301.D14(_BANK1:PR1A) U301.E6(_BANK0:PT13C) U301.E7(_BANK0:PT12B/HS) U301.E11(_BANK0:PT19D) U301.F7(_BANK0:PT16A/HS) U301.F9(_BANK0:PT19C) U301.F10(_BANK0:PT21C) U301.G6(_BANK5:PL3D) U301.G11(_BANK1:PR5C) U301.H6(_BANK5:PL5D) U301.H11(_BANK1:PR9C) U301.J6(_BANK4:PL6D) U301.K6(_BANK4:PL10D) U301.K11(_BANK1:PR12C) U301.L5(_BANK3:PL11D) U301.L7(_BANK2:PB8D) U301.L12(_BANK1:PR10D) U301.M6(_BANK2:PB11C)

### Buses
RPI0_GPIO7,RPI0_GPIO12,RPI0_GPIO16,RPI0_GPIO20,RPI0_GPIO21,RPI0_SCLK,RPI0_MISO,RPI0_MOSI,RPI0_CE,RPI0_RX0,RPI0_TX0,RPI0_LED0
RPIP_GPIO[12..19],RPIP_MISO0,RPIP_MOSI0,RPIP_SCLK0,RPIP_CS0
FT_D[0..7],FT_DXF#,FT_TXE#,FT_RD#,FT_WR#,FT_SIWUA,FT_CLKOUT,FT_OE#
FP_C5,FP_C7,FP_D6,FP_D7
JTAGENB,PROGRAMN,INITN,FP_E10,FP_D11,FP_C12,DONE
TRG[0..3]
TDI,TDO,TCK,TMS
ADS_CS#[0..1],ADS_SDO#[0..1],ADS_SCLK#[0..1]
RAM0_SIO[0..3],RAM0_/CE,RAM0_SCLK

### Notes on the sheet
- FPGA
- To Spare Connector
  J601 page 6
- To RPi 0
  J101 page 1
- To PSRAM
  U601, U602 page 6
- To Aux ADCs
  U501 U503 page 5
- To FTDI USB
  A601 page 6
- To Remote Trigger Receiver
  JP601 page 6
- To RP2040
  U201 page 2
- XO 48 MHz
  ECS-2520MV-480-CN-TR
- FPGA
  JTAG

## Sheet 4 of 10: Backplanes
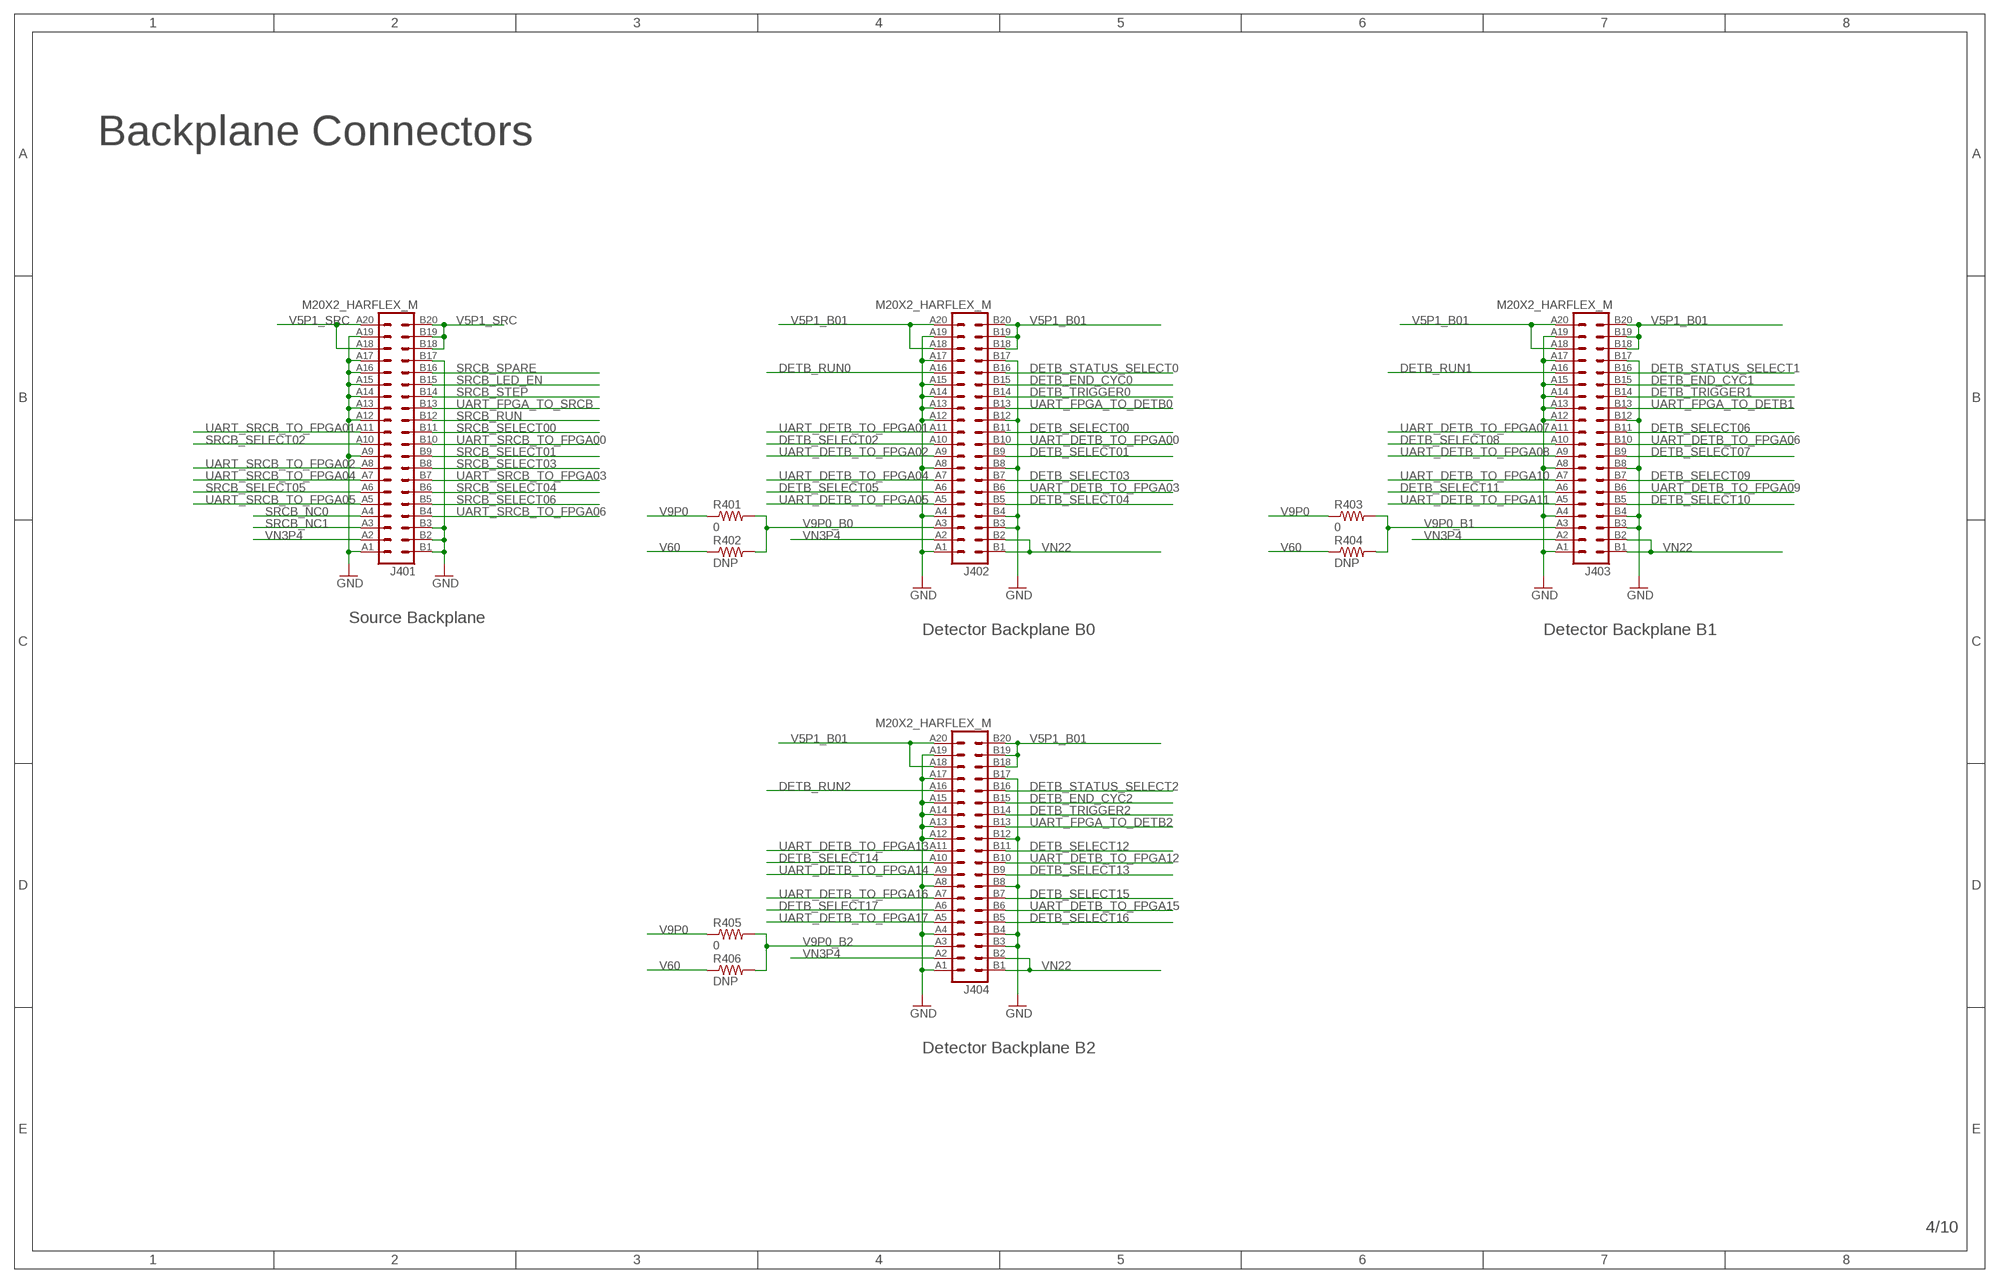
[diagram p3: schematic, sheet 4]

### Parts
J401  M20X2_HARFLEX_M  [M20X2_HARFLEX_M]
J402  M20X2_HARFLEX_M  [M20X2_HARFLEX_M]
J403  M20X2_HARFLEX_M  [M20X2_HARFLEX_M]
J404  M20X2_HARFLEX_M  [M20X2_HARFLEX_M]
R401  0  RESISTOR0603-RES  [0603-RES]
R402  DNP  RESISTOR0603-RES  [0603-RES]
R403  0  RESISTOR0603-RES  [0603-RES]
R404  DNP  RESISTOR0603-RES  [0603-RES]
R405  0  RESISTOR0603-RES  [0603-RES]
R406  DNP  RESISTOR0603-RES  [0603-RES]

### Nets
DETB_END_CYC0: J402.B15 ; also sheet 3
DETB_END_CYC1: J403.B15 ; also sheet 3
DETB_END_CYC2: J404.B15 ; also sheet 3
DETB_RUN0: J402.A16 ; also sheet 3
DETB_RUN1: J403.A16 ; also sheet 3
DETB_RUN2: J404.A16 ; also sheet 3
DETB_SELECT00: J402.B11 ; also sheet 3
DETB_SELECT01: J402.B9 ; also sheet 3
DETB_SELECT02: J402.A10 ; also sheet 3
DETB_SELECT03: J402.B7 ; also sheet 3
DETB_SELECT04: J402.B5 ; also sheet 3
DETB_SELECT05: J402.A6 ; also sheet 3
DETB_SELECT06: J403.B11 ; also sheet 3
DETB_SELECT07: J403.B9 ; also sheet 3
DETB_SELECT08: J403.A10 ; also sheet 3
DETB_SELECT09: J403.B7 ; also sheet 3
DETB_SELECT10: J403.B5 ; also sheet 3
DETB_SELECT11: J403.A6 ; also sheet 3
DETB_SELECT12: J404.B11 ; also sheet 3
DETB_SELECT13: J404.B9 ; also sheet 3
DETB_SELECT14: J404.A10 ; also sheet 3
DETB_SELECT15: J404.B7 ; also sheet 3
DETB_SELECT16: J404.B5 ; also sheet 3
DETB_SELECT17: J404.A6 ; also sheet 3
DETB_STATUS_SELECT0: J402.B16 ; also sheet 3
DETB_STATUS_SELECT1: J403.B16 ; also sheet 3
DETB_STATUS_SELECT2: J404.B16 ; also sheet 3
DETB_TRIGGER0: J402.B14 ; also sheet 3
DETB_TRIGGER1: J403.B14 ; also sheet 3
DETB_TRIGGER2: J404.B14 ; also sheet 3
GND: J401.A1 J401.A9 J401.A12 J401.A13 J401.A14 J401.A15 J401.A16 J401.A17 J401.A19 J401.B1 J401.B2 J401.B3 J401.B17 J402.A1 J402.A4 J402.A8 J402.A12 J402.A13 J402.A14 J402.A15 J402.A17 J402.A19 J402.B3 J402.B4 J402.B8 J402.B12 J402.B17 J403.A1 J403.A4 J403.A8 J403.A12 J403.A13 J403.A14 J403.A15 J403.A17 J403.A19 J403.B3 J403.B4 J403.B8 J403.B12 J403.B17 J404.A1 J404.A4 J404.A8 J404.A12 J404.A13 J404.A14 J404.A15 J404.A17 J404.A19 J404.B3 J404.B4 J404.B8 J404.B12 J404.B17 ; also sheet 1,2,3,5,6,7,8,9,10
SRCB_LED_EN: J401.B15 ; also sheet 3
SRCB_NC0: J401.A4 ; also sheet 3
SRCB_NC1: J401.A3 ; also sheet 3
SRCB_RUN: J401.B12 ; also sheet 3
SRCB_SELECT00: J401.B11 ; also sheet 3
SRCB_SELECT01: J401.B9 ; also sheet 3
SRCB_SELECT02: J401.A10 ; also sheet 3
SRCB_SELECT03: J401.B8 ; also sheet 3
SRCB_SELECT04: J401.B6 ; also sheet 3
SRCB_SELECT05: J401.A6 ; also sheet 3
SRCB_SELECT06: J401.B5 ; also sheet 3
SRCB_SPARE: J401.B16 ; also sheet 3
SRCB_STEP: J401.B14 ; also sheet 3
UART_DETB_TO_FPGA00: J402.B10 ; also sheet 3
UART_DETB_TO_FPGA01: J402.A11 ; also sheet 3
UART_DETB_TO_FPGA02: J402.A9 ; also sheet 3
UART_DETB_TO_FPGA03: J402.B6 ; also sheet 3
UART_DETB_TO_FPGA04: J402.A7 ; also sheet 3
UART_DETB_TO_FPGA05: J402.A5 ; also sheet 3
UART_DETB_TO_FPGA06: J403.B10 ; also sheet 3
UART_DETB_TO_FPGA07: J403.A11 ; also sheet 3
UART_DETB_TO_FPGA08: J403.A9 ; also sheet 3
UART_DETB_TO_FPGA09: J403.B6 ; also sheet 3
UART_DETB_TO_FPGA10: J403.A7 ; also sheet 3
UART_DETB_TO_FPGA11: J403.A5 ; also sheet 3
UART_DETB_TO_FPGA12: J404.B10 ; also sheet 3
UART_DETB_TO_FPGA13: J404.A11 ; also sheet 3
UART_DETB_TO_FPGA14: J404.A9 ; also sheet 3
UART_DETB_TO_FPGA15: J404.B6 ; also sheet 3
UART_DETB_TO_FPGA16: J404.A7 ; also sheet 3
UART_DETB_TO_FPGA17: J404.A5 ; also sheet 3
UART_FPGA_TO_DETB0: J402.B13 ; also sheet 3
UART_FPGA_TO_DETB1: J403.B13 ; also sheet 3
UART_FPGA_TO_DETB2: J404.B13 ; also sheet 3
UART_FPGA_TO_SRCB: J401.B13 ; also sheet 3
UART_SRCB_TO_FPGA00: J401.B10 ; also sheet 3
UART_SRCB_TO_FPGA01: J401.A11 ; also sheet 3
UART_SRCB_TO_FPGA02: J401.A8 ; also sheet 3
UART_SRCB_TO_FPGA03: J401.B7 ; also sheet 3
UART_SRCB_TO_FPGA04: J401.A7 ; also sheet 3
UART_SRCB_TO_FPGA05: J401.A5 ; also sheet 3
UART_SRCB_TO_FPGA06: J401.B4 ; also sheet 3
V5P1_B01: J402.A18 J402.A20 J402.B18 J402.B19 J402.B20 J403.A18 J403.A20 J403.B18 J403.B19 J403.B20 J404.A18 J404.A20 J404.B18 J404.B19 J404.B20 ; also sheet 7
V5P1_SRC: J401.A18 J401.A20 J401.B18 J401.B19 J401.B20 ; also sheet 7
V9P0: R401.1 R403.1 R405.1 ; also sheet 9
V9P0_B0: J402.A3 R401.2 R402.2
V9P0_B1: J403.A3 R403.2 R404.2
V9P0_B2: J404.A3 R405.2 R406.2
V60: R402.1 R404.1 R406.1 ; also sheet 9
VN3P4: J401.A2 J402.A2 J403.A2 J404.A2 ; also sheet 8
VN22: J402.B1 J402.B2 J403.B1 J403.B2 J404.B1 J404.B2 ; also sheet 8

### Notes on the sheet
- Backplane Connectors
- Source Backplane
- Detector Backplane B0 | Detector Backplane B1
- Detector Backplane B2

## Sheet 5 of 10: Aux IO
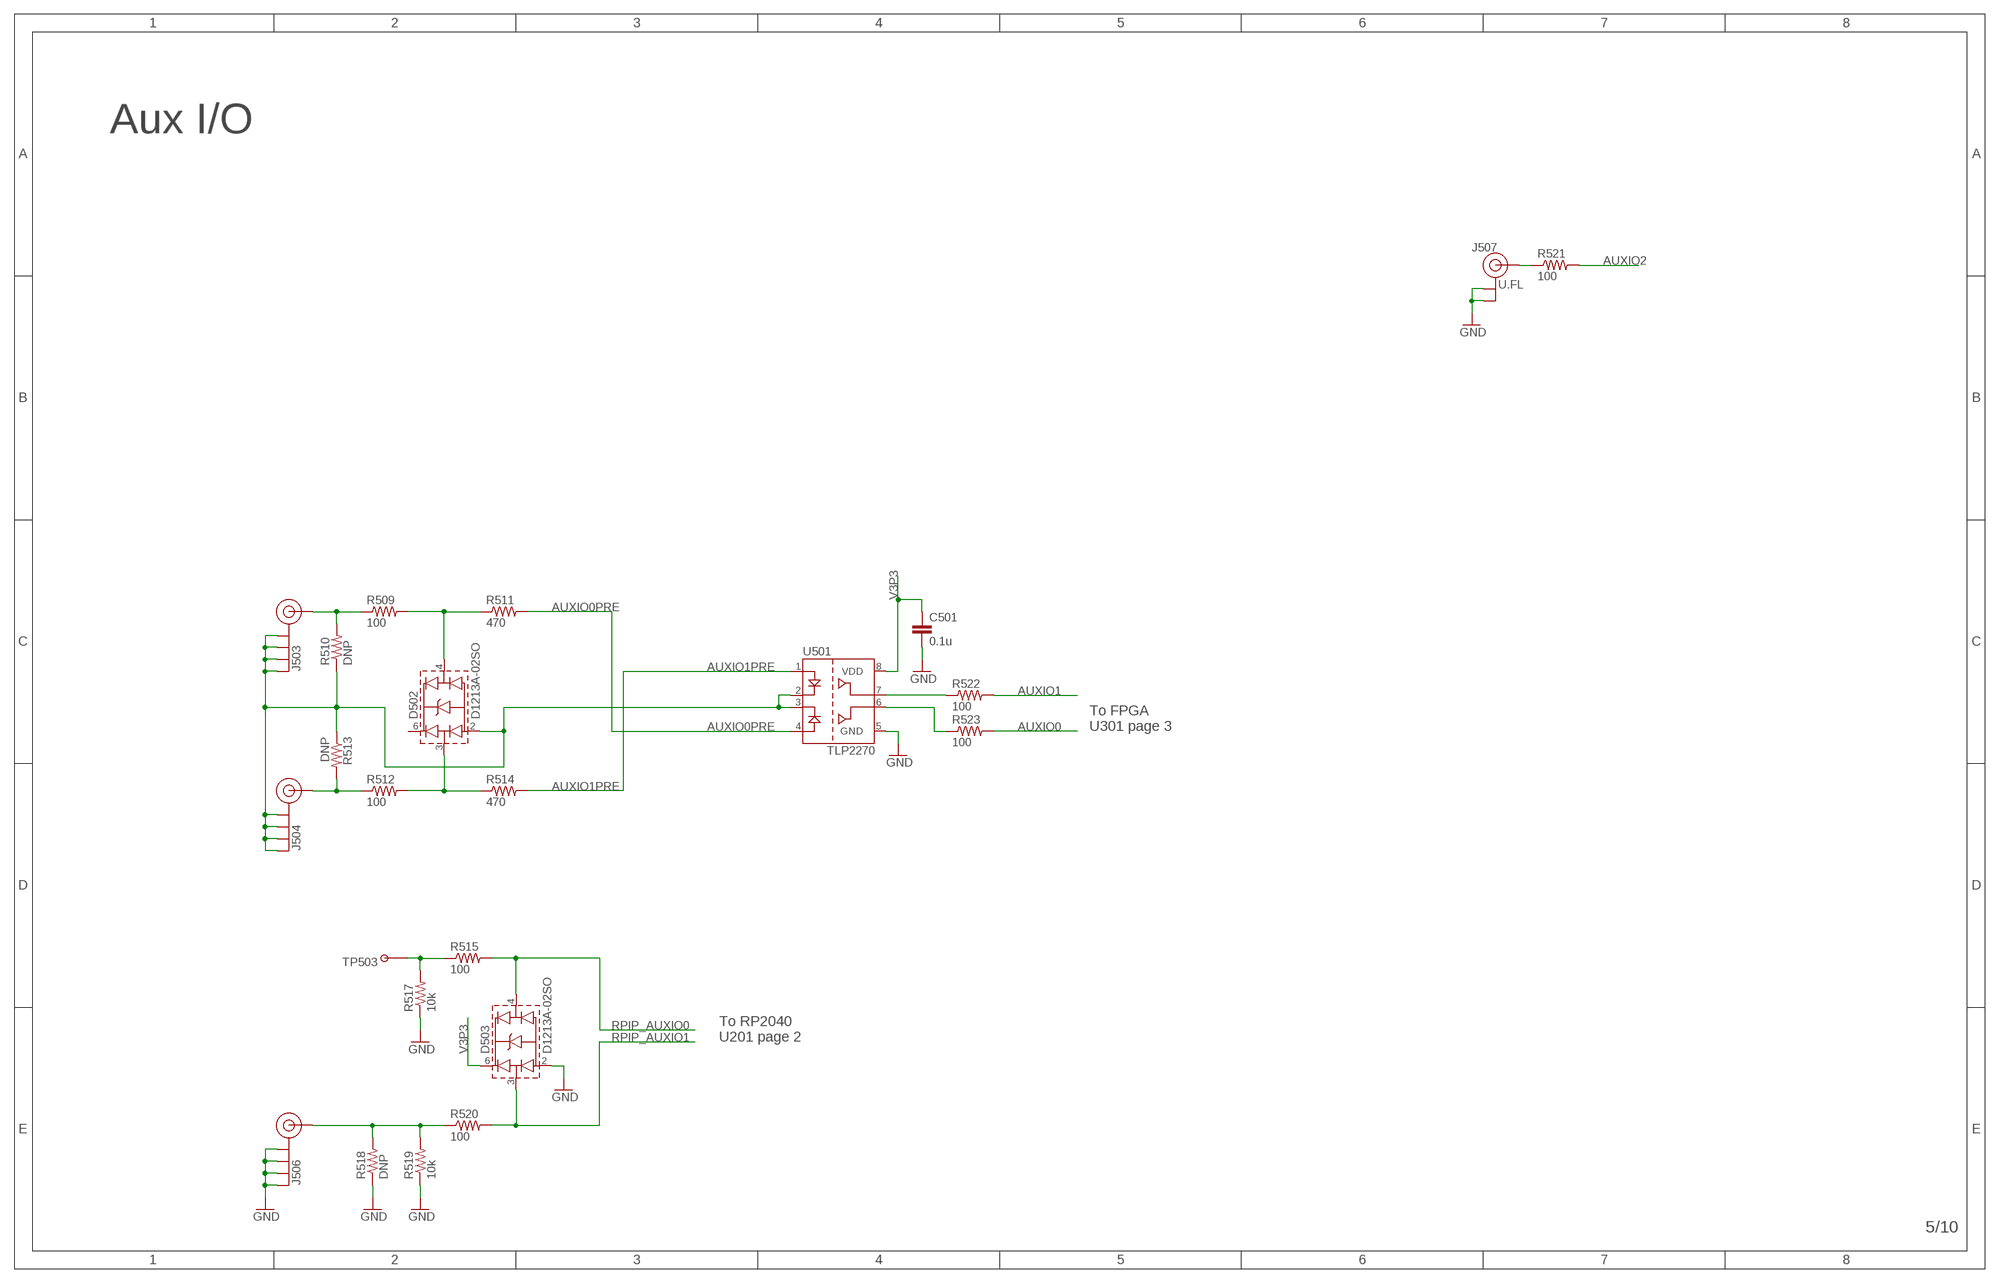
[diagram p4: schematic, sheet 5]

### Parts
C501  0.1u  CAP0402-CAP  [0402-CAP]
D502  D1213A-02SO  [SOT23-6]
D503  D1213A-02SO  [SOT23-6]
J503  SMA_MMCX_PTH_RA  [MMCX_PTH_RA]
J504  SMA_MMCX_PTH_RA  [MMCX_PTH_RA]
J506  SMA_MMCX_PTH_RA  [MMCX_PTH_RA]
J507  U.FL  [U.FL]
R509  100  RESISTOR0402-RES  [0402-RES]
R510  DNP  RESISTOR0805-RES  [0805]
R511  470  RESISTOR0402-RES  [0402-RES]
R512  100  RESISTOR0402-RES  [0402-RES]
R513  DNP  RESISTOR0805-RES  [0805]
R514  470  RESISTOR0402-RES  [0402-RES]
R515  100  RESISTOR0402-RES  [0402-RES]
R517  10k  RESISTOR0402-RES  [0402-RES]
R518  DNP  RESISTOR0805-RES  [0805]
R519  10k  RESISTOR0402-RES  [0402-RES]
R520  100  RESISTOR0402-RES  [0402-RES]
R521  100  RESISTOR0402-RES  [0402-RES]
R522  100  RESISTOR0402-RES  [0402-RES]
R523  100  RESISTOR0402-RES  [0402-RES]
TP503  TESTPOINT_ROUND  [TESTPAD_ROUND]
U501  TLP2270  [SO08L]

### Nets
AUXIO0: R523.2 ; also sheet 3
AUXIO0PRE: R511.2 U501.4(A2)
AUXIO1: R522.2 ; also sheet 3
AUXIO1PRE: R514.2 U501.1(A1)
AUXIO2: R521.2 ; also sheet 3
GND: C501.2 D503.2(VN) J506.G@1(GND) J506.G@2(GND) J506.G@3(GND) J506.G@4(GND) J507.P$1(GND) J507.P$2(GND) R517.1 R518.1 R519.1 U501.5(GND) ; also sheet 1,2,3,4,6,7,8,9,10
GNDI_AUX: D502.2(VN) J503.G@1(GND) J503.G@2(GND) J503.G@3(GND) J503.G@4(GND) J504.G@1(GND) J504.G@2(GND) J504.G@3(GND) J504.G@4(GND) R510.1 R513.1 U501.2(C1) U501.3(C2)
N$34: D502.4(CH2) R509.2 R511.1
N$38: D502.3(CH1) R512.2 R514.1
N$48: R522.1 U501.7(OUT1)
N$49: R523.1 U501.6(OUT2)
N$53: R515.1 R517.2 TP503.P$1
N$60: J503.C(SIGNAL) R509.1 R510.2
N$62: J504.C(SIGNAL) R512.1 R513.2
N$95: J507.P$3(SIGNAL) R521.1
N$96: J506.C(SIGNAL) R518.2 R519.2 R520.1
RPIP_AUXIO0: D503.4(CH2) R515.2 ; also sheet 2
RPIP_AUXIO1: D503.3(CH1) R520.2 ; also sheet 2
V3P3: C501.1 D503.6(VP) U501.8(VDD) ; also sheet 2,3,6,7,9,10

### Notes on the sheet
- Aux I/O
- To FPGA
  U301 page 3
- To RP2040
  U201 page 2

## Sheet 6 of 10: FTDI USB / Misc
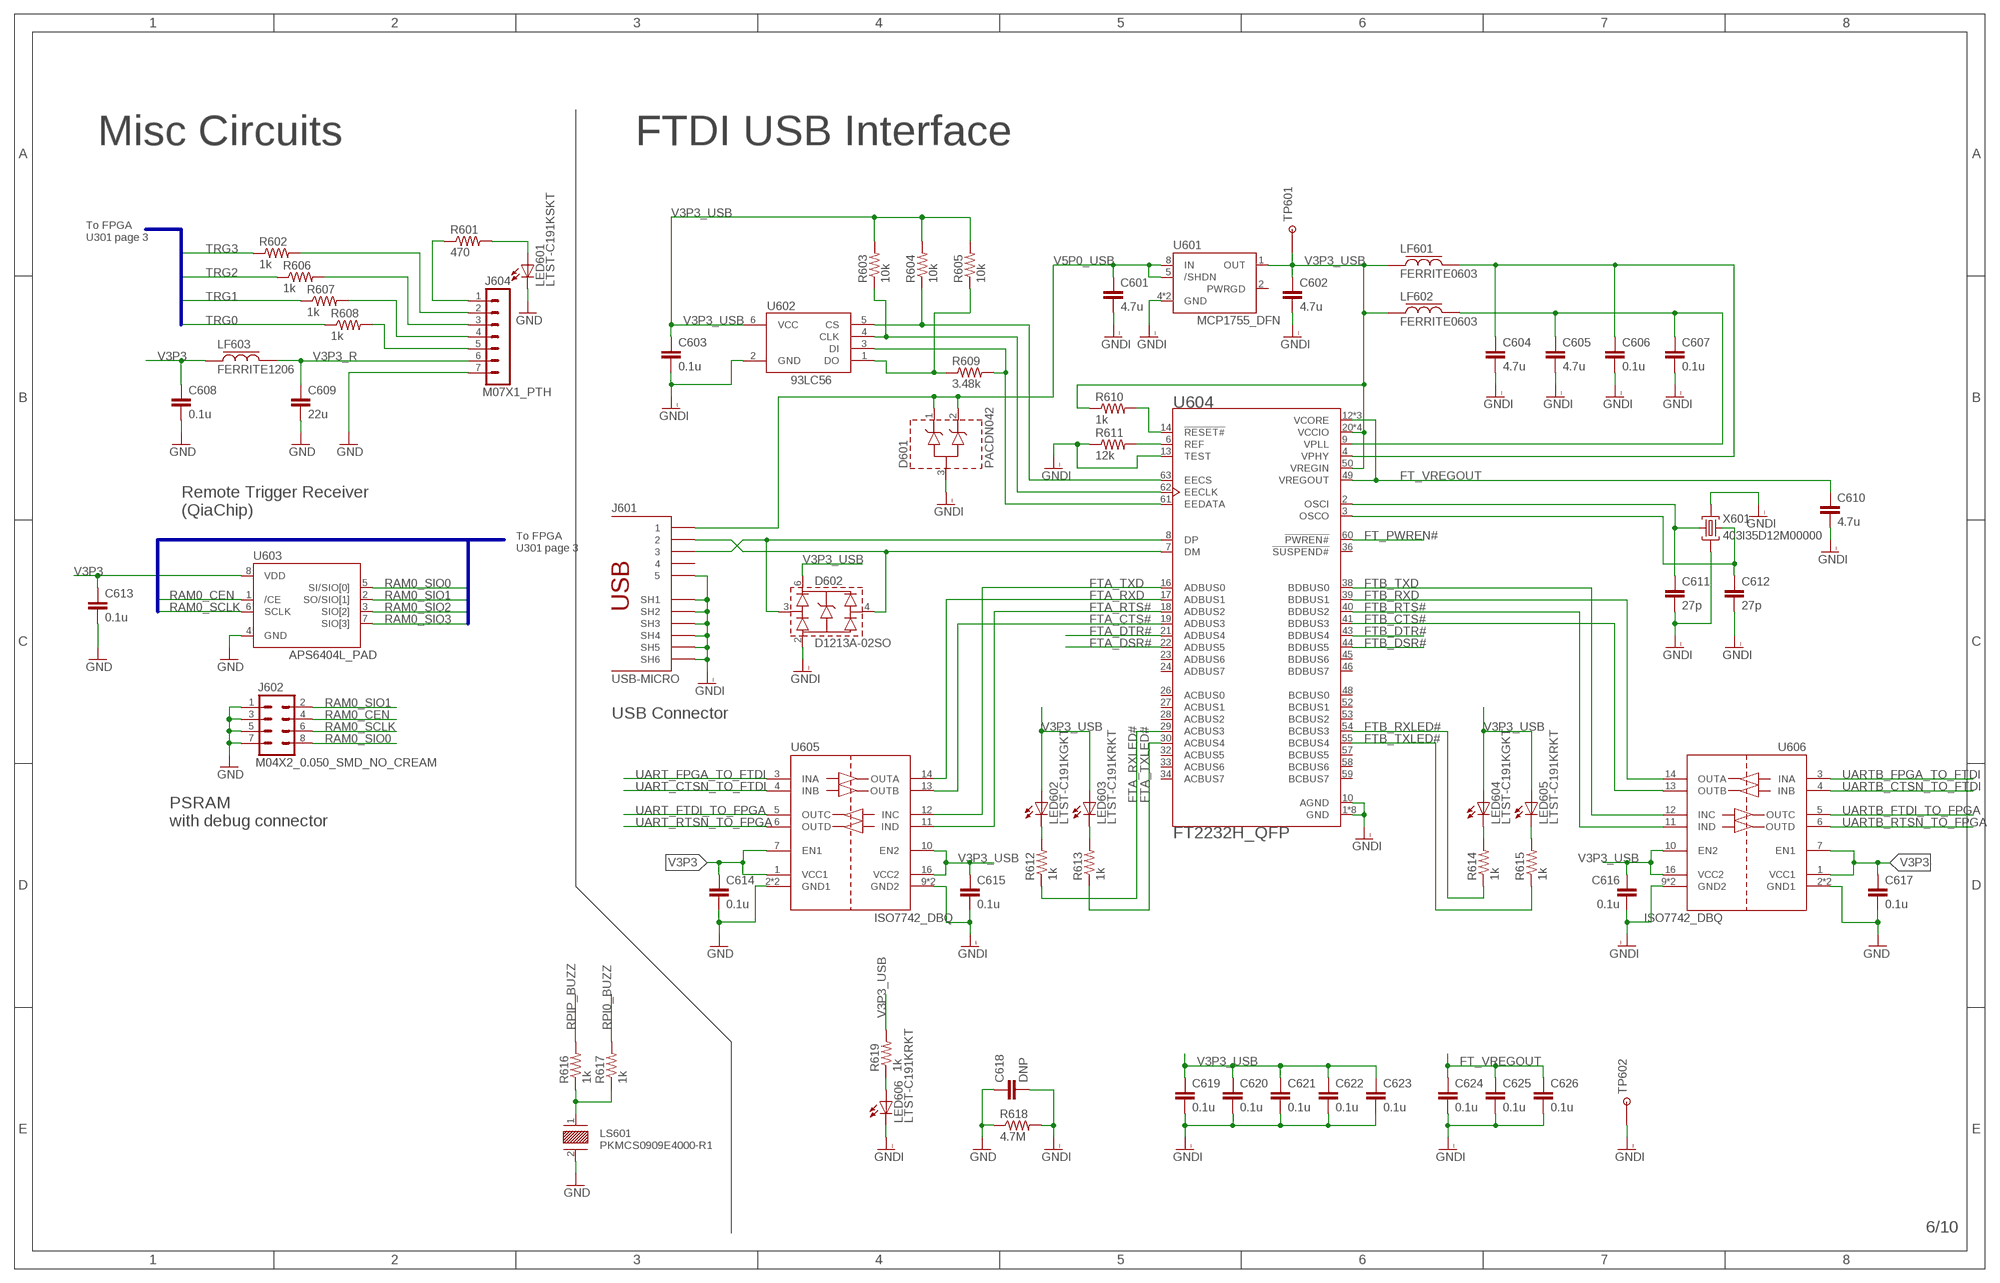
[diagram p5: schematic, sheet 6]

### Parts
C601  4.7u  CAP0402-CAP  [0402-CAP]
C602  4.7u  CAP0402-CAP  [0402-CAP]
C603  0.1u  CAP0402-CAP  [0402-CAP]
C604  4.7u  CAP0402-CAP  [0402-CAP]
C605  4.7u  CAP0402-CAP  [0402-CAP]
C606  0.1u  CAP0402-CAP  [0402-CAP]
C607  0.1u  CAP0402-CAP  [0402-CAP]
C608  0.1u  CAP0402-CAP  [0402-CAP]
C609  22u  CAP0805-CAP  [0805-CAP]
C610  4.7u  CAP0402-CAP  [0402-CAP]
C611  27p  CAP0402-CAP  [0402-CAP]
C612  27p  CAP0402-CAP  [0402-CAP]
C613  0.1u  CAP0402-CAP  [0402-CAP]
C614  0.1u  CAP0402-CAP  [0402-CAP]
C615  0.1u  CAP0402-CAP  [0402-CAP]
C616  0.1u  CAP0402-CAP  [0402-CAP]
C617  0.1u  CAP0402-CAP  [0402-CAP]
C618  DNP  CAP1210  [1210]
C619  0.1u  CAP0402-CAP  [0402-CAP]
C620  0.1u  CAP0402-CAP  [0402-CAP]
C621  0.1u  CAP0402-CAP  [0402-CAP]
C622  0.1u  CAP0402-CAP  [0402-CAP]
C623  0.1u  CAP0402-CAP  [0402-CAP]
C624  0.1u  CAP0402-CAP  [0402-CAP]
C625  0.1u  CAP0402-CAP  [0402-CAP]
C626  0.1u  CAP0402-CAP  [0402-CAP]
D601  PACDN042  [SOT23-3]
D602  D1213A-02SO  [SOT23-6]
J601  USB-MICRO  [USB-MICRO]
J602  M04X2_0.050_SMD_NO_CREAM  [M04X2_0.050_SMD_NO_CREAM]
J604  M07X1_PTH  [M07X1_PTH]
LED601  LTST-C191KSKT  LED0603  [LED-0603]
LED602  LTST-C191KGKT  LED0603  [LED-0603]
LED603  LTST-C191KRKT  LED0603  [LED-0603]
LED604  LTST-C191KGKT  LED0603  [LED-0603]
LED605  LTST-C191KRKT  LED0603  [LED-0603]
LED606  LTST-C191KRKT  LED0603  [LED-0603]
LF601  FERRITE0603  [0603-FER]
LF602  FERRITE0603  [0603-FER]
LF603  FERRITE1206  [1206]
LS601  PKMCS0909E4000-R1  [XDCR_PKMCS0909E4000-R1]
R601  470  RESISTOR0402-RES  [0402-RES]
R602  1k  RESISTOR0402-RES  [0402-RES]
R603  10k  RESISTOR0402-RES  [0402-RES]
R604  10k  RESISTOR0402-RES  [0402-RES]
R605  10k  RESISTOR0402-RES  [0402-RES]
R606  1k  RESISTOR0402-RES  [0402-RES]
R607  1k  RESISTOR0402-RES  [0402-RES]
R608  1k  RESISTOR0402-RES  [0402-RES]
R609  3.48k  RESISTOR0402-RES  [0402-RES]
R610  1k  RESISTOR0402-RES  [0402-RES]
R611  12k  RESISTOR0402-RES  [0402-RES]
R612  1k  RESISTOR0402-RES  [0402-RES]
R613  1k  RESISTOR0402-RES  [0402-RES]
R614  1k  RESISTOR0402-RES  [0402-RES]
R615  1k  RESISTOR0402-RES  [0402-RES]
R616  1k  RESISTOR0402-RES  [0402-RES]
R617  1k  RESISTOR0402-RES  [0402-RES]
R618  4.7M  RESISTOR2010  [R2010]
R619  1k  RESISTOR0402-RES  [0402-RES]
TP601  TESTPOINT_ROUND  [TESTPAD_ROUND]
TP602  TESTPOINT1X01  [1X01]
U601  MCP1755_DFN  [DFN8_2X3MM]
U602  93LC56  [SOT23-6]
U603  APS6404L_PAD  [USON8L-2X3MM_APM]
U604  FT2232H_QFP  FT2232HQQFP  [QFP50P1200X1200X160-64N]
U605  ISO7742_DBQ  [SSOP16]
U606  ISO7742_DBQ  [SSOP16]
X601  403I35D12M00000  CRYSTAL-3.2-2.5  [CRYSTAL-3.2-2.5]

### Nets
FT_PWREN#: U604.60(!PWREN#)
FT_VREGOUT: C610.1 C624.1 C625.1 C626.1 U604.12(VCORE) U604.37(VCORE) U604.49(VREGOUT) U604.64(VCORE)
FTA_CTS#: U604.19(ADBUS3) U605.13(OUTB)
FTA_DSR#: U604.22(ADBUS5)
FTA_DTR#: U604.21(ADBUS4)
FTA_RTS#: U604.18(ADBUS2) U605.11(IND)
FTA_RXD: U604.17(ADBUS1) U605.14(OUTA)
FTA_RXLED#: R612.1 U604.29(ACBUS3)
FTA_TXD: U604.16(ADBUS0) U605.12(INC)
FTA_TXLED#: R613.1 U604.30(ACBUS4)
FTB_CTS#: U604.41(BDBUS3) U606.13(OUTB)
FTB_DSR#: U604.44(BDBUS5)
FTB_DTR#: U604.43(BDBUS4)
FTB_RTS#: U604.40(BDBUS2) U606.11(IND)
FTB_RXD: U604.39(BDBUS1) U606.14(OUTA)
FTB_RXLED#: R614.1 U604.54(BCBUS3)
FTB_TXD: U604.38(BDBUS0) U606.12(INC)
FTB_TXLED#: R615.1 U604.55(BCBUS4)
GND: C608.2 C609.2 C613.2 C614.2 C617.2 C618.1 J602.1 J602.3 J602.5 J602.7 J604.7 LED601.C LS601.2 R618.1 U603.4(GND) U605.2(GND1) U605.8(GND1) U606.2(GND1) U606.8(GND1) ; also sheet 1,2,3,4,5,7,8,9,10
GNDI: C601.2 C602.2 C603.2 C604.2 C605.2 C606.2 C607.2 C610.2 C611.2 C612.2 C615.2 C616.2 C618.2 C619.2 C620.2 C621.2 C622.2 C623.2 C624.2 C625.2 C626.2 D601.3(A) D602.2(VN) J601.5 J601.SH1 J601.SH2 J601.SH3 J601.SH4 J601.SH5 J601.SH6 LED606.C R611.1 R618.2 TP602.1 U601.4(GND) U601.P(GND) U602.2(GND) U604.1(GND) U604.5(GND) U604.10(AGND) U604.11(GND) U604.13(TEST) U604.15(GND) U604.25(GND) U604.35(GND) U604.47(GND) U604.51(GND) U605.9(GND2) U605.15(GND2) U606.9(GND2) U606.15(GND2) X601.2(GND) X601.4(GND)
LED: J604.1 R601.1
N$14: LED606.A R619.1
N$24: R604.1 U602.5(CS) U604.63(EECS)
N$50: R603.1 U602.4(CLK) U604.62(EECLK)
N$54: R605.1 R609.1 U602.1(DO)
N$59: LS601.1 R616.1 R617.1
N$61: R609.2 U602.3(DI) U604.61(EEDATA)
N$65: C605.1 C607.1 LF602.2 U604.9(VPLL)
N$66: C604.1 C606.1 LF601.2 U604.4(VPHY)
N$68: R610.2 U604.14(!RESET#)
N$69: R611.2 U604.6(REF)
N$70: C611.1 U604.2(OSCI) X601.1(C1)
N$71: C612.1 U604.3(OSCO) X601.3(C2)
N$72: LED604.C R614.2
N$73: LED605.C R615.2
N$74: LED602.C R612.2
N$77: LED603.C R613.2
N$99: D602.3(CH1) J601.3 U604.8(DP)
N$100: D602.4(CH2) J601.2 U604.7(DM)
N$211: J604.5 R608.2
N$212: J604.4 R607.2
N$213: J604.3 R606.2
N$214: J604.2 R602.2
N$215: LED601.A R601.2
RAM0_CEN: J602.4 U603.1(/CE) ; also sheet 3
RAM0_SCLK: J602.6 U603.6(SCLK) ; also sheet 3
RAM0_SIO0: J602.8 U603.5(SI/SIO[0]) ; also sheet 3
RAM0_SIO1: J602.2 U603.2(SO/SIO[1]) ; also sheet 3
RAM0_SIO2: U603.3(SIO[2]) ; also sheet 3
RAM0_SIO3: U603.7(SIO[3]) ; also sheet 3
RPI0_BUZZ: R617.2 ; also sheet 1
RPIP_BUZZ: R616.2 ; also sheet 2
TRG0: R608.1 ; also sheet 3
TRG1: R607.1 ; also sheet 3
TRG2: R606.1 ; also sheet 3
TRG3: R602.1 ; also sheet 3
UART_CTSN_TO_FTDI: U605.4(INB) ; also sheet 3
UART_FPGA_TO_FTDI: U605.3(INA) ; also sheet 3
UART_FTDI_TO_FPGA: U605.5(OUTC) ; also sheet 3
UART_RTSN_TO_FPGA: U605.6(OUTD) ; also sheet 3
UARTB_CTSN_TO_FTDI: U606.4(INB) ; also sheet 3
UARTB_FPGA_TO_FTDI: U606.3(INA) ; also sheet 3
UARTB_FTDI_TO_FPGA: U606.5(OUTC) ; also sheet 3
UARTB_RTSN_TO_FPGA: U606.6(OUTD) ; also sheet 3
V3P3: C608.1 C613.1 C614.1 C617.1 LF603.1 U603.8(VDD) U605.1(VCC1) U605.7(EN1) U606.1(VCC1) U606.7(EN1) ; also sheet 2,3,5,7,9,10
V3P3_R: C609.1 J604.6 LF603.2
V3P3_USB: C602.1 C603.1 C615.1 C616.1 C619.1 C620.1 C621.1 C622.1 C623.1 D602.6(VP) LED602.A LED603.A LED604.A LED605.A LF601.1 LF602.1 R603.2 R604.2 R605.2 R610.1 R619.2 TP601.P$1 U601.1(OUT) U602.6(VCC) U604.20(VCCIO) U604.31(VCCIO) U604.42(VCCIO) U604.50(VREGIN) U604.56(VCCIO) U605.10(EN2) U605.16(VCC2) U606.10(EN2) U606.16(VCC2)
V5P0_USB: C601.1 D601.1(C) D601.2(C) J601.1 U601.5(/SHDN) U601.8(IN)
Unconnected: J601.4 U601.2(PWRGD) U604.23(ADBUS6) U604.24(ADBUS7) U604.26(ACBUS0) U604.27(ACBUS1) U604.28(ACBUS2) U604.32(ACBUS5) U604.33(ACBUS6) U604.34(ACBUS7) U604.36(!SUSPEND#) U604.45(BDBUS6) U604.46(BDBUS7) U604.48(BCBUS0) U604.52(BCBUS1) U604.53(BCBUS2) U604.57(BCBUS5) U604.58(BCBUS6) U604.59(BCBUS7)

### Buses
TRG[0..3]
RAM0_SIO[0..3],RAM0_/CE,RAM0_SCLK

### Notes on the sheet
- Misc Circuits | FTDI USB Interface
- To FPGA
  U301 page 3
- Remote Trigger Receiver
  (QiaChip)
- To FPGA
  U301 page 3
- USB Connector
- PSRAM
  with debug connector

## Sheet 7 of 10: VReg
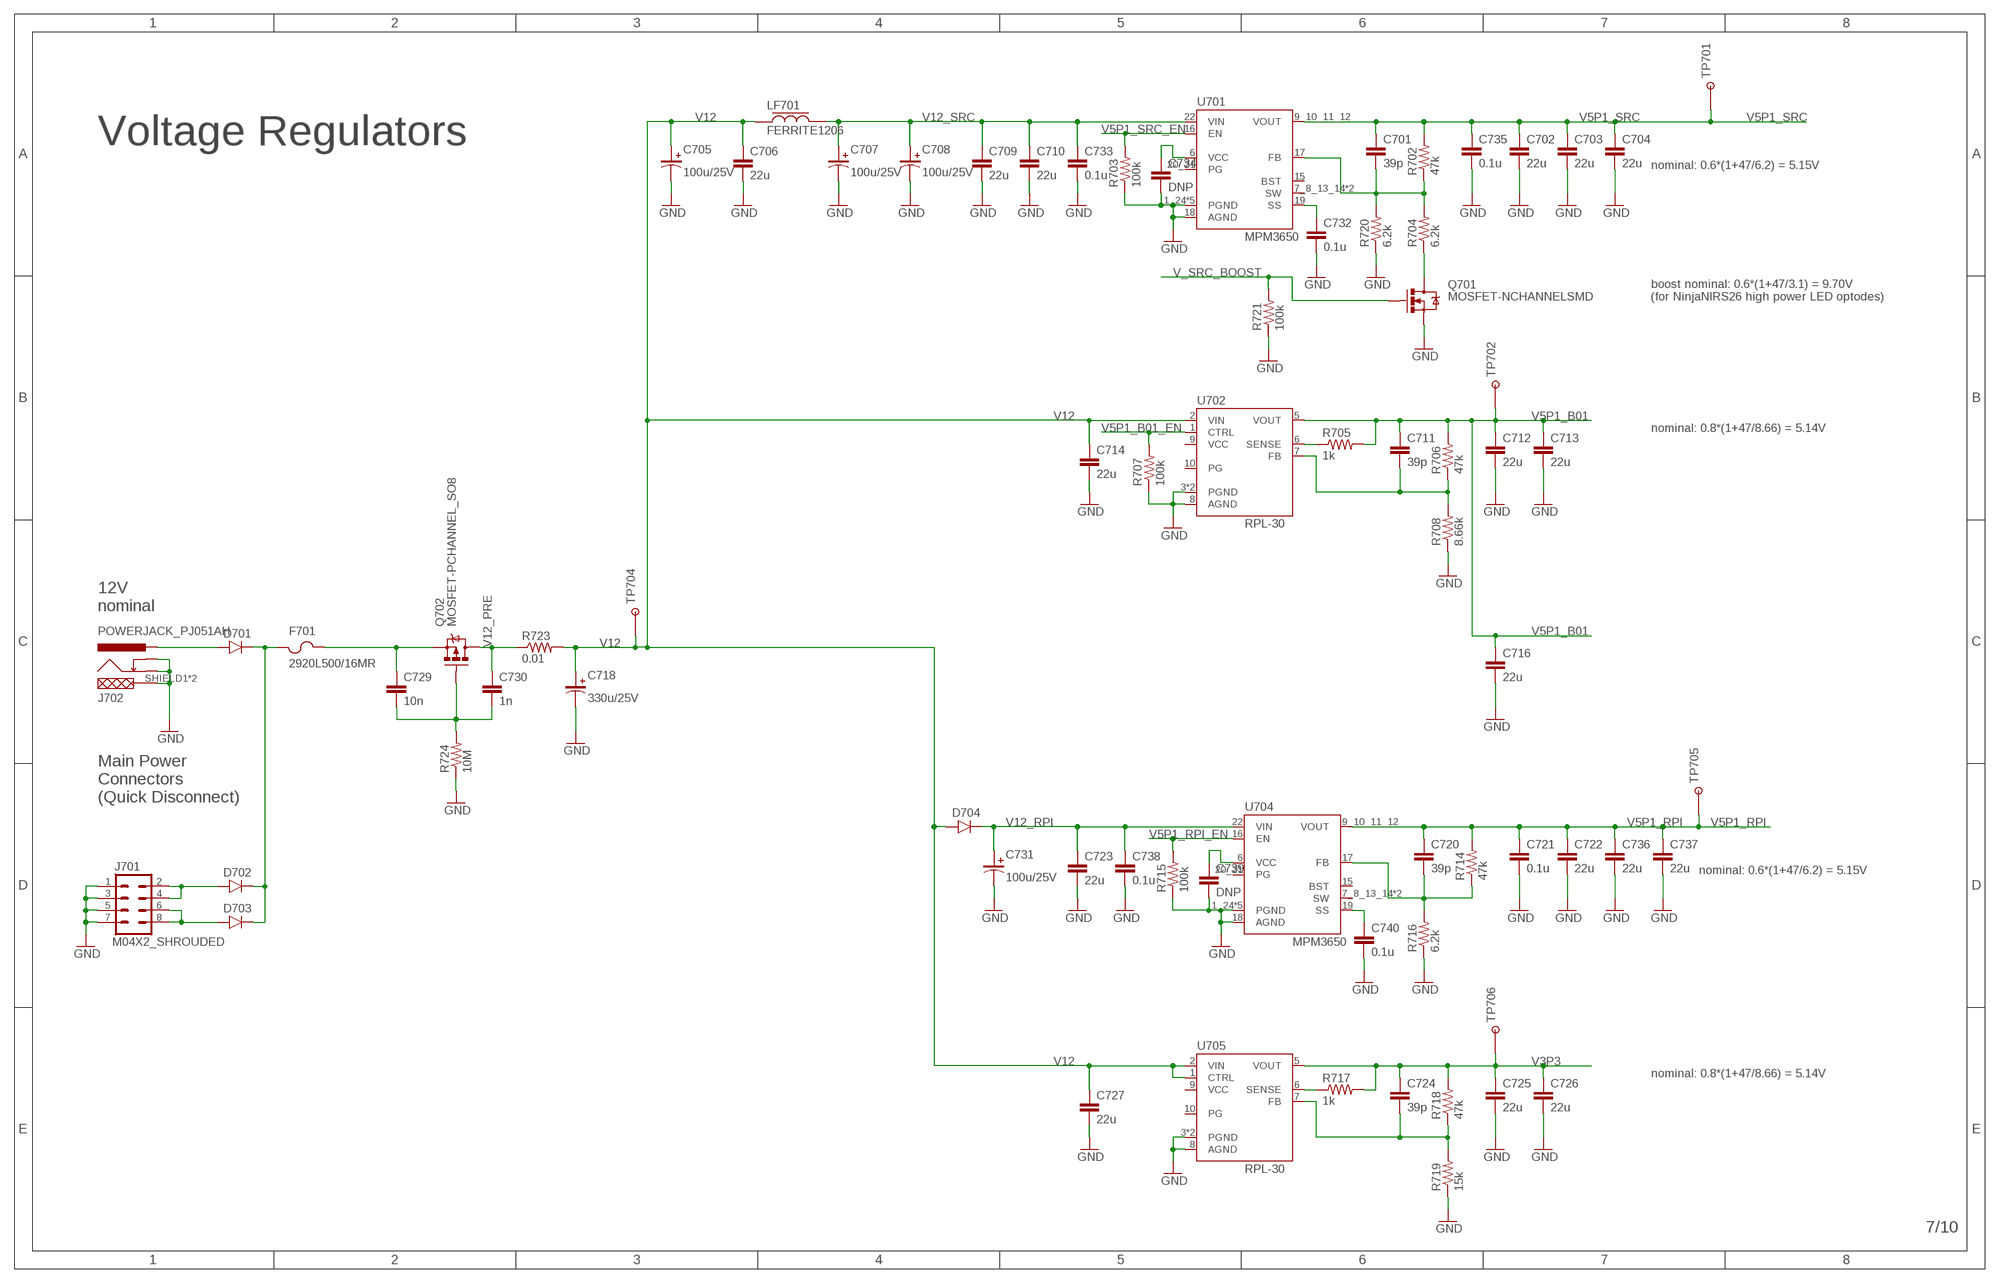
[diagram p6: schematic, sheet 7]

### Parts
C701  39p  CAP0402-CAP  [0402-CAP]
C702  22u  CAP0805-CAP  [0805-CAP]
C703  22u  CAP0805-CAP  [0805-CAP]
C704  22u  CAP0805-CAP  [0805-CAP]
C705  100u/25V  CAP-POL2917  [2917-CAP]
C706  22u  CAP0805-CAP  [0805-CAP]
C707  100u/25V  CAP-POL2917  [2917-CAP]
C708  100u/25V  CAP-POL2917  [2917-CAP]
C709  22u  CAP0805-CAP  [0805-CAP]
C710  22u  CAP0805-CAP  [0805-CAP]
C711  39p  CAP0402-CAP  [0402-CAP]
C712  22u  CAP0805-CAP  [0805-CAP]
C713  22u  CAP0805-CAP  [0805-CAP]
C714  22u  CAP0805-CAP  [0805-CAP]
C716  22u  CAP0805-CAP  [0805-CAP]
C718  330u/25V  CAP-POL8.0MM  [CAP-SMD-POL-8X10]
C720  39p  CAP0402-CAP  [0402-CAP]
C721  0.1u  CAP0402-CAP  [0402-CAP]
C722  22u  CAP0805-CAP  [0805-CAP]
C723  22u  CAP0805-CAP  [0805-CAP]
C724  39p  CAP0402-CAP  [0402-CAP]
C725  22u  CAP0805-CAP  [0805-CAP]
C726  22u  CAP0805-CAP  [0805-CAP]
C727  22u  CAP0805-CAP  [0805-CAP]
C729  10n  CAP0603-CAP  [0603-CAP]
C730  1n  CAP0603-CAP  [0603-CAP]
C731  100u/25V  CAP-POL2917  [2917-CAP]
C732  0.1u  CAP0402-CAP  [0402-CAP]
C733  0.1u  CAP0402-CAP  [0402-CAP]
C734  DNP  CAP0402-CAP  [0402-CAP]
C735  0.1u  CAP0402-CAP  [0402-CAP]
C736  22u  CAP0805-CAP  [0805-CAP]
C737  22u  CAP0805-CAP  [0805-CAP]
C738  0.1u  CAP0402-CAP  [0402-CAP]
C739  DNP  CAP0402-CAP  [0402-CAP]
C740  0.1u  CAP0402-CAP  [0402-CAP]
D701  DIODESOD128  [SOD128]
D702  DIODESOD128  [SOD128]
D703  DIODESOD128  [SOD128]
D704  DIODESOD128  [SOD128]
F701  2920L500/16MR  FUSE_2920  [2920-FUSE]
J701  M04X2_SHROUDED  [M04X2-SHROUDED]
J702  POWERJACK_PJ051AH  [PJ051AH]
LF701  FERRITE1206  [1206]
Q701  MOSFET-NCHANNELSMD  [SOT23-3]
Q702  MOSFET-PCHANNEL_SO8  [SO08]
R702  47k  RESISTOR0402-RES  [0402-RES]
R703  100k  RESISTOR0402-RES  [0402-RES]
R704  6.2k  RESISTOR0402-RES  [0402-RES]
R705  1k  RESISTOR0402-RES  [0402-RES]
R706  47k  RESISTOR0402-RES  [0402-RES]
R707  100k  RESISTOR0402-RES  [0402-RES]
R708  8.66k  RESISTOR0402-RES  [0402-RES]
R714  47k  RESISTOR0402-RES  [0402-RES]
R715  100k  RESISTOR0402-RES  [0402-RES]
R716  6.2k  RESISTOR0402-RES  [0402-RES]
R717  1k  RESISTOR0402-RES  [0402-RES]
R718  47k  RESISTOR0402-RES  [0402-RES]
R719  15k  RESISTOR0402-RES  [0402-RES]
R720  6.2k  RESISTOR0402-RES  [0402-RES]
R721  100k  RESISTOR0402-RES  [0402-RES]
R723  0.01  RESISTOR1206  [1206]
R724  10M  RESISTOR0805-RES  [0805]
TP701  TESTPOINT_ROUND  [TESTPAD_ROUND]
TP702  TESTPOINT_ROUND  [TESTPAD_ROUND]
TP704  TESTPOINT_ROUND  [TESTPAD_ROUND]
TP705  TESTPOINT_ROUND  [TESTPAD_ROUND]
TP706  TESTPOINT_ROUND  [TESTPAD_ROUND]
U701  MPM3650  [QFN-24-MPS_FULL_CREAM]
U702  RPL-30  [RPL-30]
U704  MPM3650  [QFN-24-MPS_FULL_CREAM]
U705  RPL-30  [RPL-30]

### Nets
GND: C702.2 C703.2 C704.2 C705.N C706.2 C707.N C708.N C709.2 C710.2 C712.2 C713.2 C714.2 C716.2 C718.N C721.2 C722.2 C723.2 C725.2 C726.2 C727.2 C731.N C732.2 C733.2 C734.2 C735.2 C736.2 C737.2 C738.2 C739.2 C740.2 J701.1 J701.3 J701.5 J701.7 J702.SHIELD1(SHIELD) J702.SHIELD2(SHIELD) J702.SLEEVE(GND) J702.SWITCH(GNDBREAK) Q701.2(S) R703.1 R707.1 R708.1 R715.1 R716.1 R719.1 R720.1 R721.1 R724.1 U701.1_24(PGND) U701.2(PGND) U701.3(PGND) U701.4(PGND) U701.5(PGND) U701.18(AGND) U702.3(PGND) U702.4(PGND) U702.8(AGND) U704.1_24(PGND) U704.2(PGND) U704.3(PGND) U704.4(PGND) U704.5(PGND) U704.18(AGND) U705.3(PGND) U705.4(PGND) U705.8(AGND) ; also sheet 1,2,3,4,5,6,8,9,10
N$3: C701.2 R702.1 R704.2 R720.2 U701.17(FB)
N$4: Q701.3(D) R704.1
N$10: C720.2 R714.1 R716.2 U704.17(FB)
N$11: D701.A J702.CENTER(PWR)
N$28: C711.2 R706.1 R708.2 U702.7(FB)
N$33: R705.1 U702.6(SENSE)
N$40: C739.1 U704.6(VCC)
N$42: C740.1 U704.19(SS)
N$44: C724.2 R718.1 R719.2 U705.7(FB)
N$45: R717.1 U705.6(SENSE)
N$52: C734.1 U701.6(VCC)
N$81: D702.A J701.2 J701.4
N$82: C729.1 F701.2 Q702.1(S) Q702.2(S) Q702.3(S)
N$87: D703.A J701.6 J701.8
N$89: D701.C D702.C D703.C F701.1
N$93: C729.2 C730.2 Q702.4(G) R724.2
N$101: C732.1 U701.19(SS)
V3P3: C724.1 C725.1 C726.1 R717.2 R718.2 TP706.P$1 U705.5(VOUT) ; also sheet 2,3,5,6,9,10
V5P1_B01: C711.1 C712.1 C713.1 C716.1 R705.2 R706.2 TP702.P$1 U702.5(VOUT) ; also sheet 4
V5P1_B01_EN: R707.2 U702.1(CTRL) ; also sheet 3
V5P1_RPI: C720.1 C721.1 C722.1 C736.1 C737.1 R714.2 TP705.P$1 U704.9_10_11_12(VOUT) ; also sheet 1
V5P1_RPI_EN: R715.2 U704.16(EN) ; also sheet 3
V5P1_SRC: C701.1 C702.1 C703.1 C704.1 C735.1 R702.2 TP701.P$1 U701.9_10_11_12(VOUT) ; also sheet 4
V5P1_SRC_EN: R703.2 U701.16(EN) ; also sheet 3
V12: C705.P C706.1 C714.1 C718.P C727.1 D704.A LF701.1 R723.2 TP704.P$1 U702.2(VIN) U705.1(CTRL) U705.2(VIN) ; also sheet 2,8,9,10
V12_PRE: C730.1 Q702.5(D) Q702.6(D) Q702.7(D) Q702.8(D) R723.1 ; also sheet 10
V12_RPI: C723.1 C731.P C738.1 D704.C U704.22(VIN)
V12_SRC: C707.P C708.P C709.1 C710.1 C733.1 LF701.2 U701.22(VIN)
V_SRC_BOOST: Q701.1(G) R721.2 ; also sheet 3
Unconnected: U701.7_8_13_14(SW) U701.15(BST) U701.20_21(PG) U701.23(SW) U702.9(VCC) U702.10(PG) U704.7_8_13_14(SW) U704.15(BST) U704.20_21(PG) U704.23(SW) U705.9(VCC) U705.10(PG)

### Notes on the sheet
- Voltage Regulators
- nominal: 0.6*(1+47/6.2) = 5.15V
- boost nominal: 0.6*(1+47/3.1) = 9.70V
  (for NinjaNIRS26 high power LED optodes)
- nominal: 0.8*(1+47/8.66) = 5.14V
- 12V
  nominal
- Main Power
  Connectors
  (Quick Disconnect)
- nominal: 0.6*(1+47/6.2) = 5.15V
- nominal: 0.8*(1+47/8.66) = 5.14V

## Sheet 8 of 10: Negative VReg
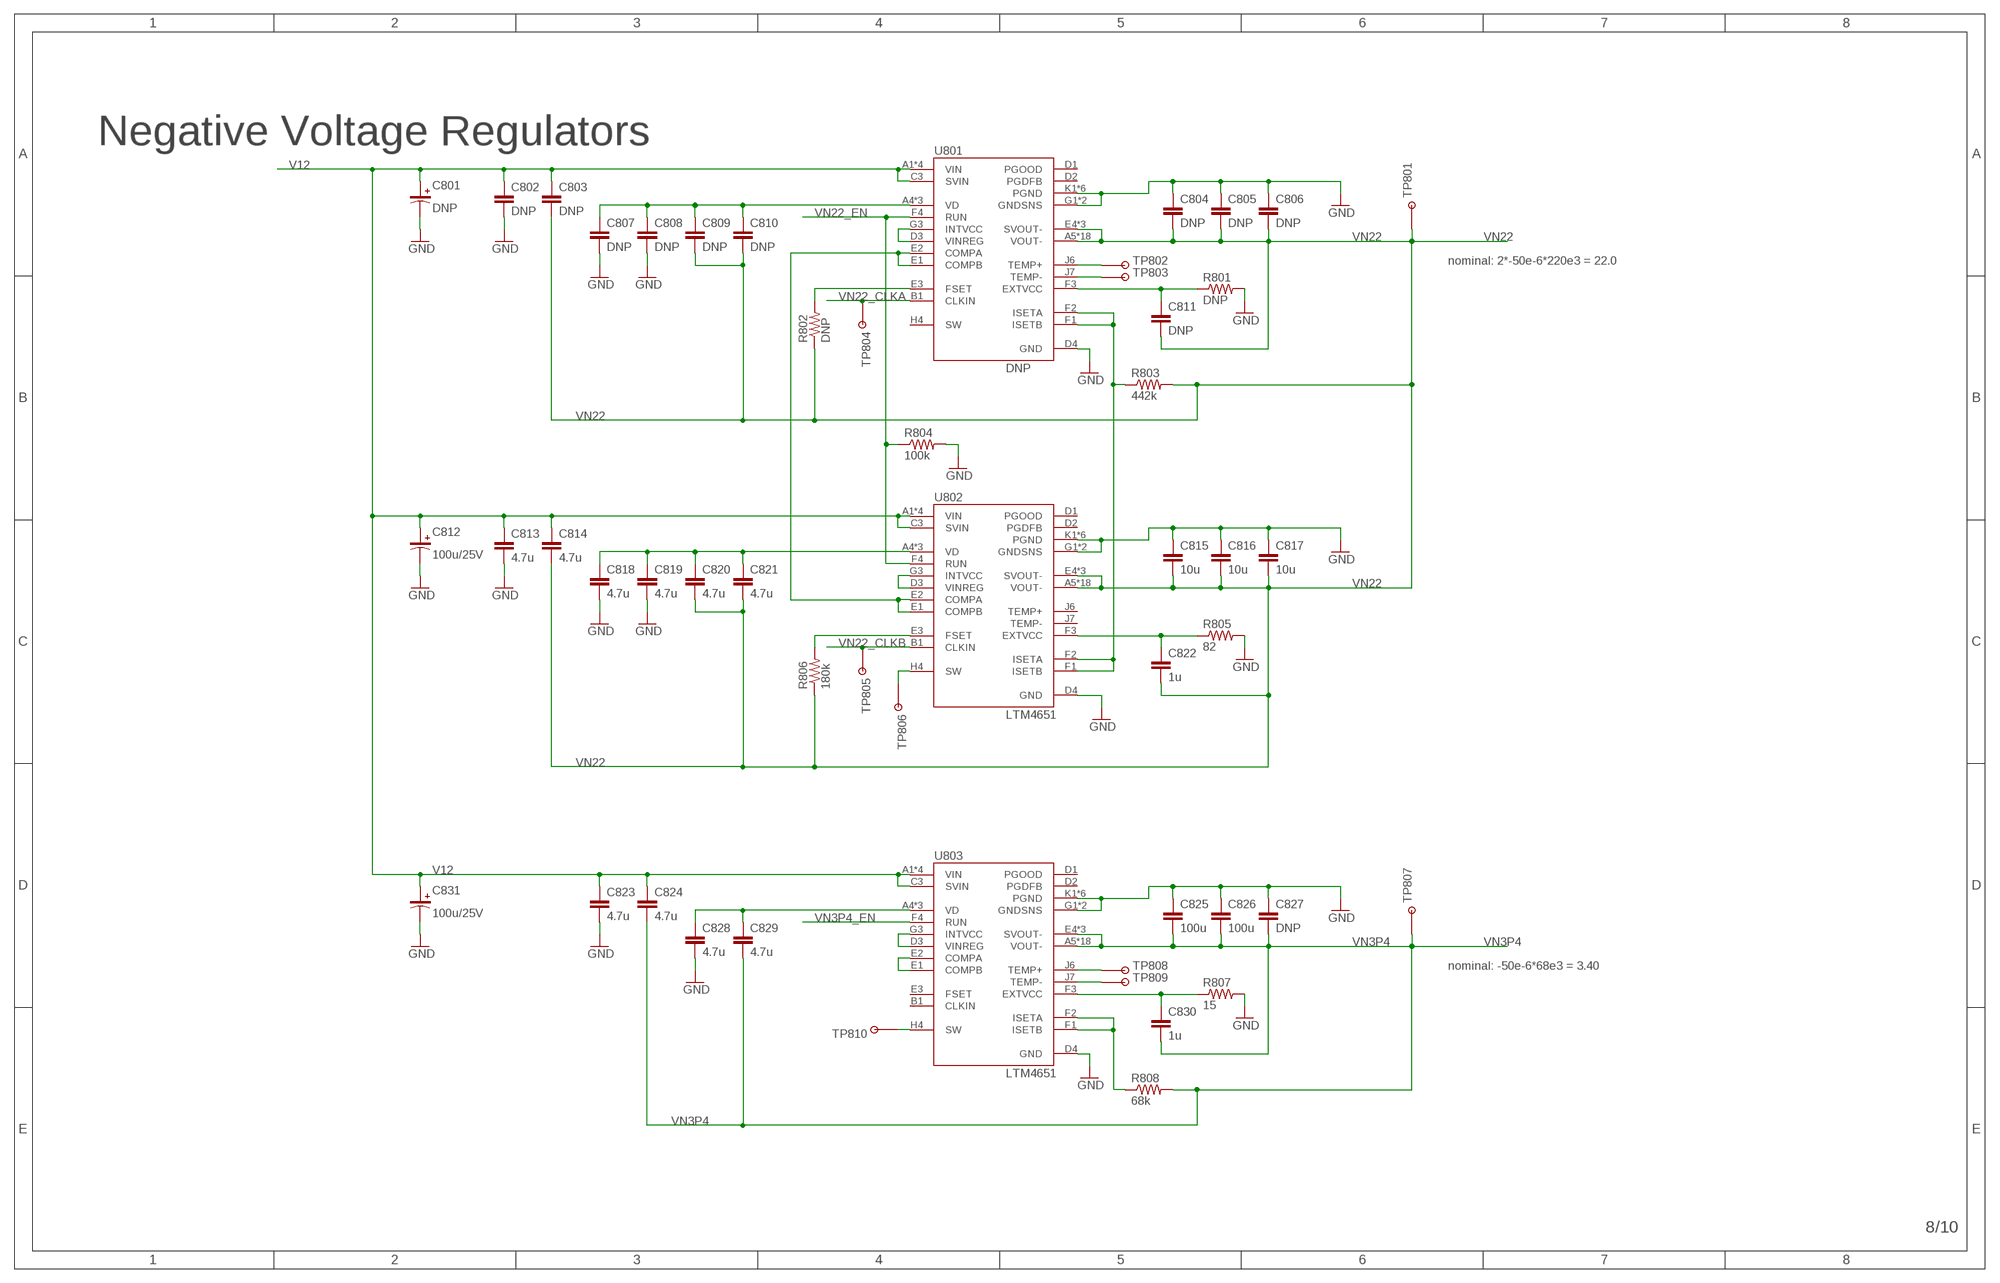
[diagram p7: schematic, sheet 8]

### Parts
C801  DNP  CAP-POL2917  [2917-CAP]
C802  DNP  CAP0805-CAP  [0805-CAP]
C803  DNP  CAP0805-CAP  [0805-CAP]
C804  DNP  CAP1206  [1206]
C805  DNP  CAP1206  [1206]
C806  DNP  CAP1206  [1206]
C807  DNP  CAP0805-CAP  [0805-CAP]
C808  DNP  CAP0805-CAP  [0805-CAP]
C809  DNP  CAP0805-CAP  [0805-CAP]
C810  DNP  CAP0805-CAP  [0805-CAP]
C811  DNP  CAP0603-CAP  [0603-CAP]
C812  100u/25V  CAP-POL2917  [2917-CAP]
C813  4.7u  CAP0805-CAP  [0805-CAP]
C814  4.7u  CAP0805-CAP  [0805-CAP]
C815  10u  CAP1206  [1206]
C816  10u  CAP1206  [1206]
C817  10u  CAP1206  [1206]
C818  4.7u  CAP0805-CAP  [0805-CAP]
C819  4.7u  CAP0805-CAP  [0805-CAP]
C820  4.7u  CAP0805-CAP  [0805-CAP]
C821  4.7u  CAP0805-CAP  [0805-CAP]
C822  1u  CAP0603-CAP  [0603-CAP]
C823  4.7u  CAP0805-CAP  [0805-CAP]
C824  4.7u  CAP0805-CAP  [0805-CAP]
C825  100u  CAP1206  [1206]
C826  100u  CAP1206  [1206]
C827  DNP  CAP1206  [1206]
C828  4.7u  CAP0805-CAP  [0805-CAP]
C829  4.7u  CAP0805-CAP  [0805-CAP]
C830  1u  CAP0603-CAP  [0603-CAP]
C831  100u/25V  CAP-POL2917  [2917-CAP]
R801  DNP  RESISTOR0402-RES  [0402-RES]
R802  DNP  RESISTOR0402-RES  [0402-RES]
R803  442k  RESISTOR0402-RES  [0402-RES]
R804  100k  RESISTOR0402-RES  [0402-RES]
R805  82  RESISTOR0402-RES  [0402-RES]
R806  180k  RESISTOR0402-RES  [0402-RES]
R807  15  RESISTOR0402-RES  [0402-RES]
R808  68k  RESISTOR0402-RES  [0402-RES]
TP801  TESTPOINT_ROUND  [TESTPAD_ROUND]
TP802  TESTPOINT_ROUND  [TESTPAD_ROUND]
TP803  TESTPOINT_ROUND  [TESTPAD_ROUND]
TP804  TESTPOINT_ROUND  [TESTPAD_ROUND]
TP805  TESTPOINT_ROUND  [TESTPAD_ROUND]
TP806  TESTPOINT_ROUND  [TESTPAD_ROUND]
TP807  TESTPOINT_ROUND  [TESTPAD_ROUND]
TP808  TESTPOINT_ROUND  [TESTPAD_ROUND]
TP809  TESTPOINT_ROUND  [TESTPAD_ROUND]
TP810  TESTPOINT_ROUND  [TESTPAD_ROUND]
U801  DNP  LTM4651  [BGA-77]
U802  LTM4651  [BGA-77]
U803  LTM4651  [BGA-77]

### Nets
GND: C801.N C802.2 C804.1 C805.1 C806.1 C807.2 C808.2 C812.N C813.2 C815.1 C816.1 C817.1 C818.2 C819.2 C823.2 C825.1 C826.1 C827.1 C828.2 C831.N R801.2 R804.2 R805.2 R807.2 U801.D4(GND) U801.G1(GNDSNS) U801.H1(GNDSNS) U801.K1(PGND) U801.K2(PGND) U801.K3(PGND) U801.L1(PGND) U801.L2(PGND) U801.L3(PGND) U802.D4(GND) U802.G1(GNDSNS) U802.H1(GNDSNS) U802.K1(PGND) U802.K2(PGND) U802.K3(PGND) U802.L1(PGND) U802.L2(PGND) U802.L3(PGND) U803.D4(GND) U803.G1(GNDSNS) U803.H1(GNDSNS) U803.K1(PGND) U803.K2(PGND) U803.K3(PGND) U803.L1(PGND) U803.L2(PGND) U803.L3(PGND) ; also sheet 1,2,3,4,5,6,7,9,10
N$1: U803.D3(VINREG) U803.G3(INTVCC)
N$2: TP802.P$1 U801.J6(TEMP+)
N$5: U803.E1(COMPB) U803.E2(COMPA)
N$6: U801.D3(VINREG) U801.G3(INTVCC)
N$7: U801.E1(COMPB) U801.E2(COMPA) U802.E1(COMPB) U802.E2(COMPA)
N$9: R802.2 U801.E3(FSET)
N$12: TP803.P$1 U801.J7(TEMP-)
N$13: C811.1 R801.1 U801.F3(EXTVCC)
N$19: C822.1 R805.1 U802.F3(EXTVCC)
N$20: TP808.P$1 U803.J6(TEMP+)
N$21: TP809.P$1 U803.J7(TEMP-)
N$22: R803.1 U801.F1(ISETB) U801.F2(ISETA) U802.F1(ISETB) U802.F2(ISETA)
N$23: U802.D3(VINREG) U802.G3(INTVCC)
N$25: TP806.P$1 U802.H4(SW)
N$26: C830.1 R807.1 U803.F3(EXTVCC)
N$27: C807.1 C808.1 C809.1 C810.1 U801.A4(VD) U801.B4(VD) U801.C4(VD)
N$31: C818.1 C819.1 C820.1 C821.1 U802.A4(VD) U802.B4(VD) U802.C4(VD)
N$32: R806.2 U802.E3(FSET)
N$36: R808.1 U803.F1(ISETB) U803.F2(ISETA)
N$39: TP810.P$1 U803.H4(SW)
N$41: C828.1 C829.1 U803.A4(VD) U803.B4(VD) U803.C4(VD)
V12: C801.P C802.1 C803.1 C812.P C813.1 C814.1 C823.1 C824.1 C831.P U801.A1(VIN) U801.A2(VIN) U801.A3(VIN) U801.B3(VIN) U801.C3(SVIN) U802.A1(VIN) U802.A2(VIN) U802.A3(VIN) U802.B3(VIN) U802.C3(SVIN) U803.A1(VIN) U803.A2(VIN) U803.A3(VIN) U803.B3(VIN) U803.C3(SVIN) ; also sheet 2,7,9,10
VN3P4: C824.2 C825.2 C826.2 C827.2 C829.2 C830.2 R808.2 TP807.P$1 U803.A5(VOUT-) U803.B5(VOUT-) U803.C2(VOUT-) U803.C5(VOUT-) U803.D5(VOUT-) U803.E4(SVOUT-) U803.E5(VOUT-) U803.F5(VOUT-) U803.G2(SVOUT-) U803.G4(VOUT-) U803.G5(VOUT-) U803.H2(SVOUT-) U803.H3(VOUT-) U803.H5(VOUT-) U803.J3(VOUT-) U803.J4(VOUT-) U803.J5(VOUT-) U803.K4(VOUT-) U803.K5(VOUT-) U803.L4(VOUT-) U803.L5(VOUT-) ; also sheet 4
VN3P4_EN: U803.F4(RUN) ; also sheet 3
VN22: C803.2 C804.2 C805.2 C806.2 C809.2 C810.2 C811.2 C814.2 C815.2 C816.2 C817.2 C820.2 C821.2 C822.2 R802.1 R803.2 R806.1 TP801.P$1 U801.A5(VOUT-) U801.B5(VOUT-) U801.C2(VOUT-) U801.C5(VOUT-) U801.D5(VOUT-) U801.E4(SVOUT-) U801.E5(VOUT-) U801.F5(VOUT-) U801.G2(SVOUT-) U801.G4(VOUT-) U801.G5(VOUT-) U801.H2(SVOUT-) U801.H3(VOUT-) U801.H5(VOUT-) U801.J3(VOUT-) U801.J4(VOUT-) U801.J5(VOUT-) U801.K4(VOUT-) U801.K5(VOUT-) U801.L4(VOUT-) U801.L5(VOUT-) U802.A5(VOUT-) U802.B5(VOUT-) U802.C2(VOUT-) U802.C5(VOUT-) U802.D5(VOUT-) U802.E4(SVOUT-) U802.E5(VOUT-) U802.F5(VOUT-) U802.G2(SVOUT-) U802.G4(VOUT-) U802.G5(VOUT-) U802.H2(SVOUT-) U802.H3(VOUT-) U802.H5(VOUT-) U802.J3(VOUT-) U802.J4(VOUT-) U802.J5(VOUT-) U802.K4(VOUT-) U802.K5(VOUT-) U802.L4(VOUT-) U802.L5(VOUT-) ; also sheet 4
VN22_CLKA: TP804.P$1 U801.B1(CLKIN) ; also sheet 3
VN22_CLKB: TP805.P$1 U802.B1(CLKIN) ; also sheet 3
VN22_EN: R804.1 U801.F4(RUN) U802.F4(RUN) ; also sheet 3
Unconnected: U801.D1(PGOOD) U801.D2(PGDFB) U801.H4(SW) U802.D1(PGOOD) U802.D2(PGDFB) U802.J6(TEMP+) U802.J7(TEMP-) U803.B1(CLKIN) U803.D1(PGOOD) U803.D2(PGDFB) U803.E3(FSET)

### Notes on the sheet
- Negative Voltage Regulators
- nominal: 2*-50e-6*220e3 = 22.0
- nominal: -50e-6*68e3 = 3.40